# Altium project pca20054.PrjPCB
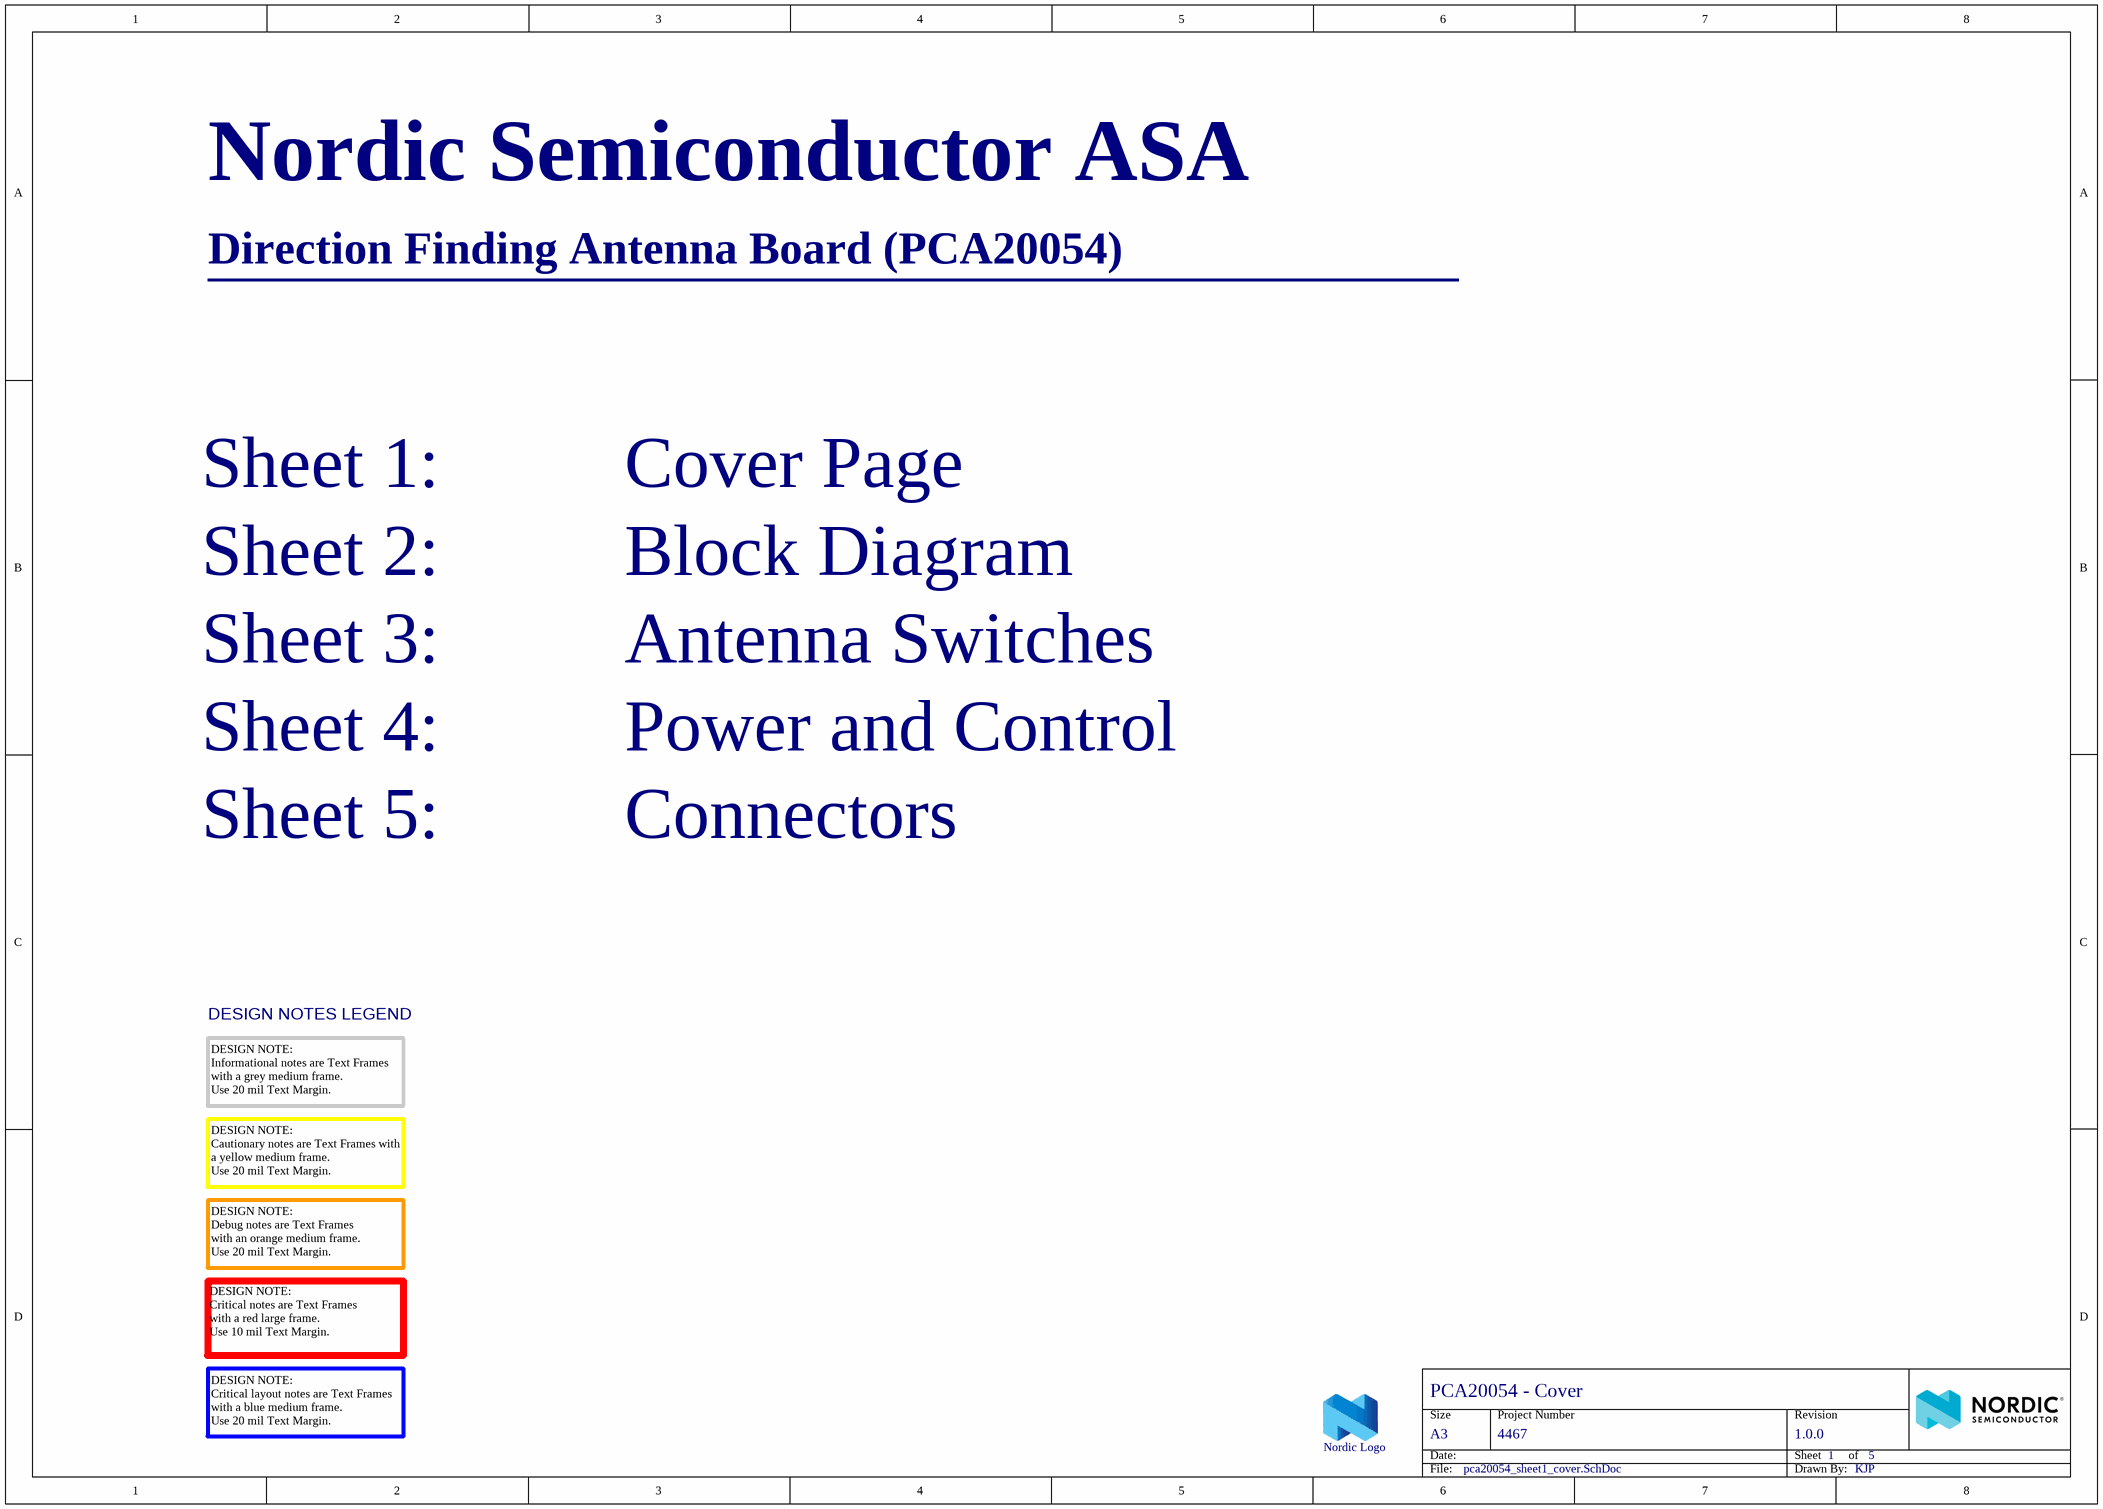
[diagram p0: pca20054_sheet1_cover.SchDoc]
Author: KJP; BoardThickness: 1.6mm; BoardTitle: Direction Finding Antenna Board; NrOfLayers: 4; Organization: Nordic Semiconductor; PCAName: PCA20054; PCBNumber: 400503; PCBRevision: 0095KJP; PCBStackup: 4001; ProjectName: Direction finding application; ProjectNumber: 4467; Revision: 1.0.0; SilkscreenColor: White; SoldermaskColor: Green; SurfaceFinish: ENIG Gold
5 sheets, 173 parts. Net scope: flat (ports and power ports of the same name join across sheets).
Board file: 400503.PcbDoc
Sheets:
  pca20054_sheet1_cover.SchDoc
  pca20054_sheet2_block_diagram.SchDoc
  pca20054_sheet3_antenna_switches.SchDoc
  pca20054_sheet4_power_control.SchDoc
  pca20054_sheet5_connectors.SchDoc

## Sheet pca20054_sheet1_cover.SchDoc: PCA20054 - Cover
size A3; Organization: Nordic Semiconductor; DocumentNumber: 1; Revision: 1.0.0; SheetNumber: 1; SheetTotal: 5; Date: 2020-02-07; CompanyName: Nordic Semiconductor; DrawnBy: KJP; ProjectNumber: 4467; ProjectName: Direction finding application

### Parts
LOGO?  Nordic Logo  [NORDIC_LOGO_LYING]  (no BOM)

### Notes on the sheet
- Nordic Semiconductor ASA
- Direction Finding Antenna Board (PCA20054)
- _________________________________________
- Sheet 1:          Cover Page
- Sheet 2:          Block Diagram
- Sheet 3:          Antenna Switches
- Sheet 4:          Power and Control
- Sheet 5:          Connectors
- DESIGN NOTES LEGEND
- DESIGN NOTE:
  Informational notes are Text Frames with a grey medium frame.
  Use 20 mil Text Margin.
- DESIGN NOTE:
  Cautionary notes are Text Frames with a yellow medium frame.
  Use 20 mil Text Margin.
- DESIGN NOTE:
  Debug notes are Text Frames
  with an orange medium frame.
  Use 20 mil Text Margin.
- DESIGN NOTE:
  Critical notes are Text Frames
  with a red large frame.
  Use 10 mil Text Margin.
- DESIGN NOTE:
  Critical layout notes are Text Frames
  with a blue medium frame.
  Use 20 mil Text Margin.
- Size
- Date:
- A3
- Project Number
- Sheet         of
- Revision
- File:
- Drawn By:

### Library data of the parts
LOGO? = Nordic Logo lying: Artikkelnr Noca: N.A.; Part Number: Nordic Logo lying; Manufacturer: *; Manufacturer Part Number: *; ComponentLink1URL: *; ComponentLink1Description: Datasheet; ComponentLink2URL: *; ComponentLink2Description: Supplier link; HelpURL: *; Footprint Doc: Nordic Logo; LatestRevisionDate: 2017-03-20; Pin Count: 0; Publisher: Nordic Semiconductor; Published: 2017-09-01; Value: Nordic Logo; Note: *; Supplier 1: *; Supplier Part Number 1: *; Supplier 2: *; Supplier Part Number 2: *; Part number IPS: N.A.

## Sheet pca20054_sheet2_block_diagram.SchDoc: PCA20054 - Block Diagram
size A3; Organization: Nordic Semiconductor; DocumentNumber: 1; Revision: 1.0.0; SheetNumber: 2; SheetTotal: 5; Date: 2020-02-07; CompanyName: Nordic Semiconductor; DrawnBy: KJP; ProjectNumber: 4467; ProjectName: Direction finding application
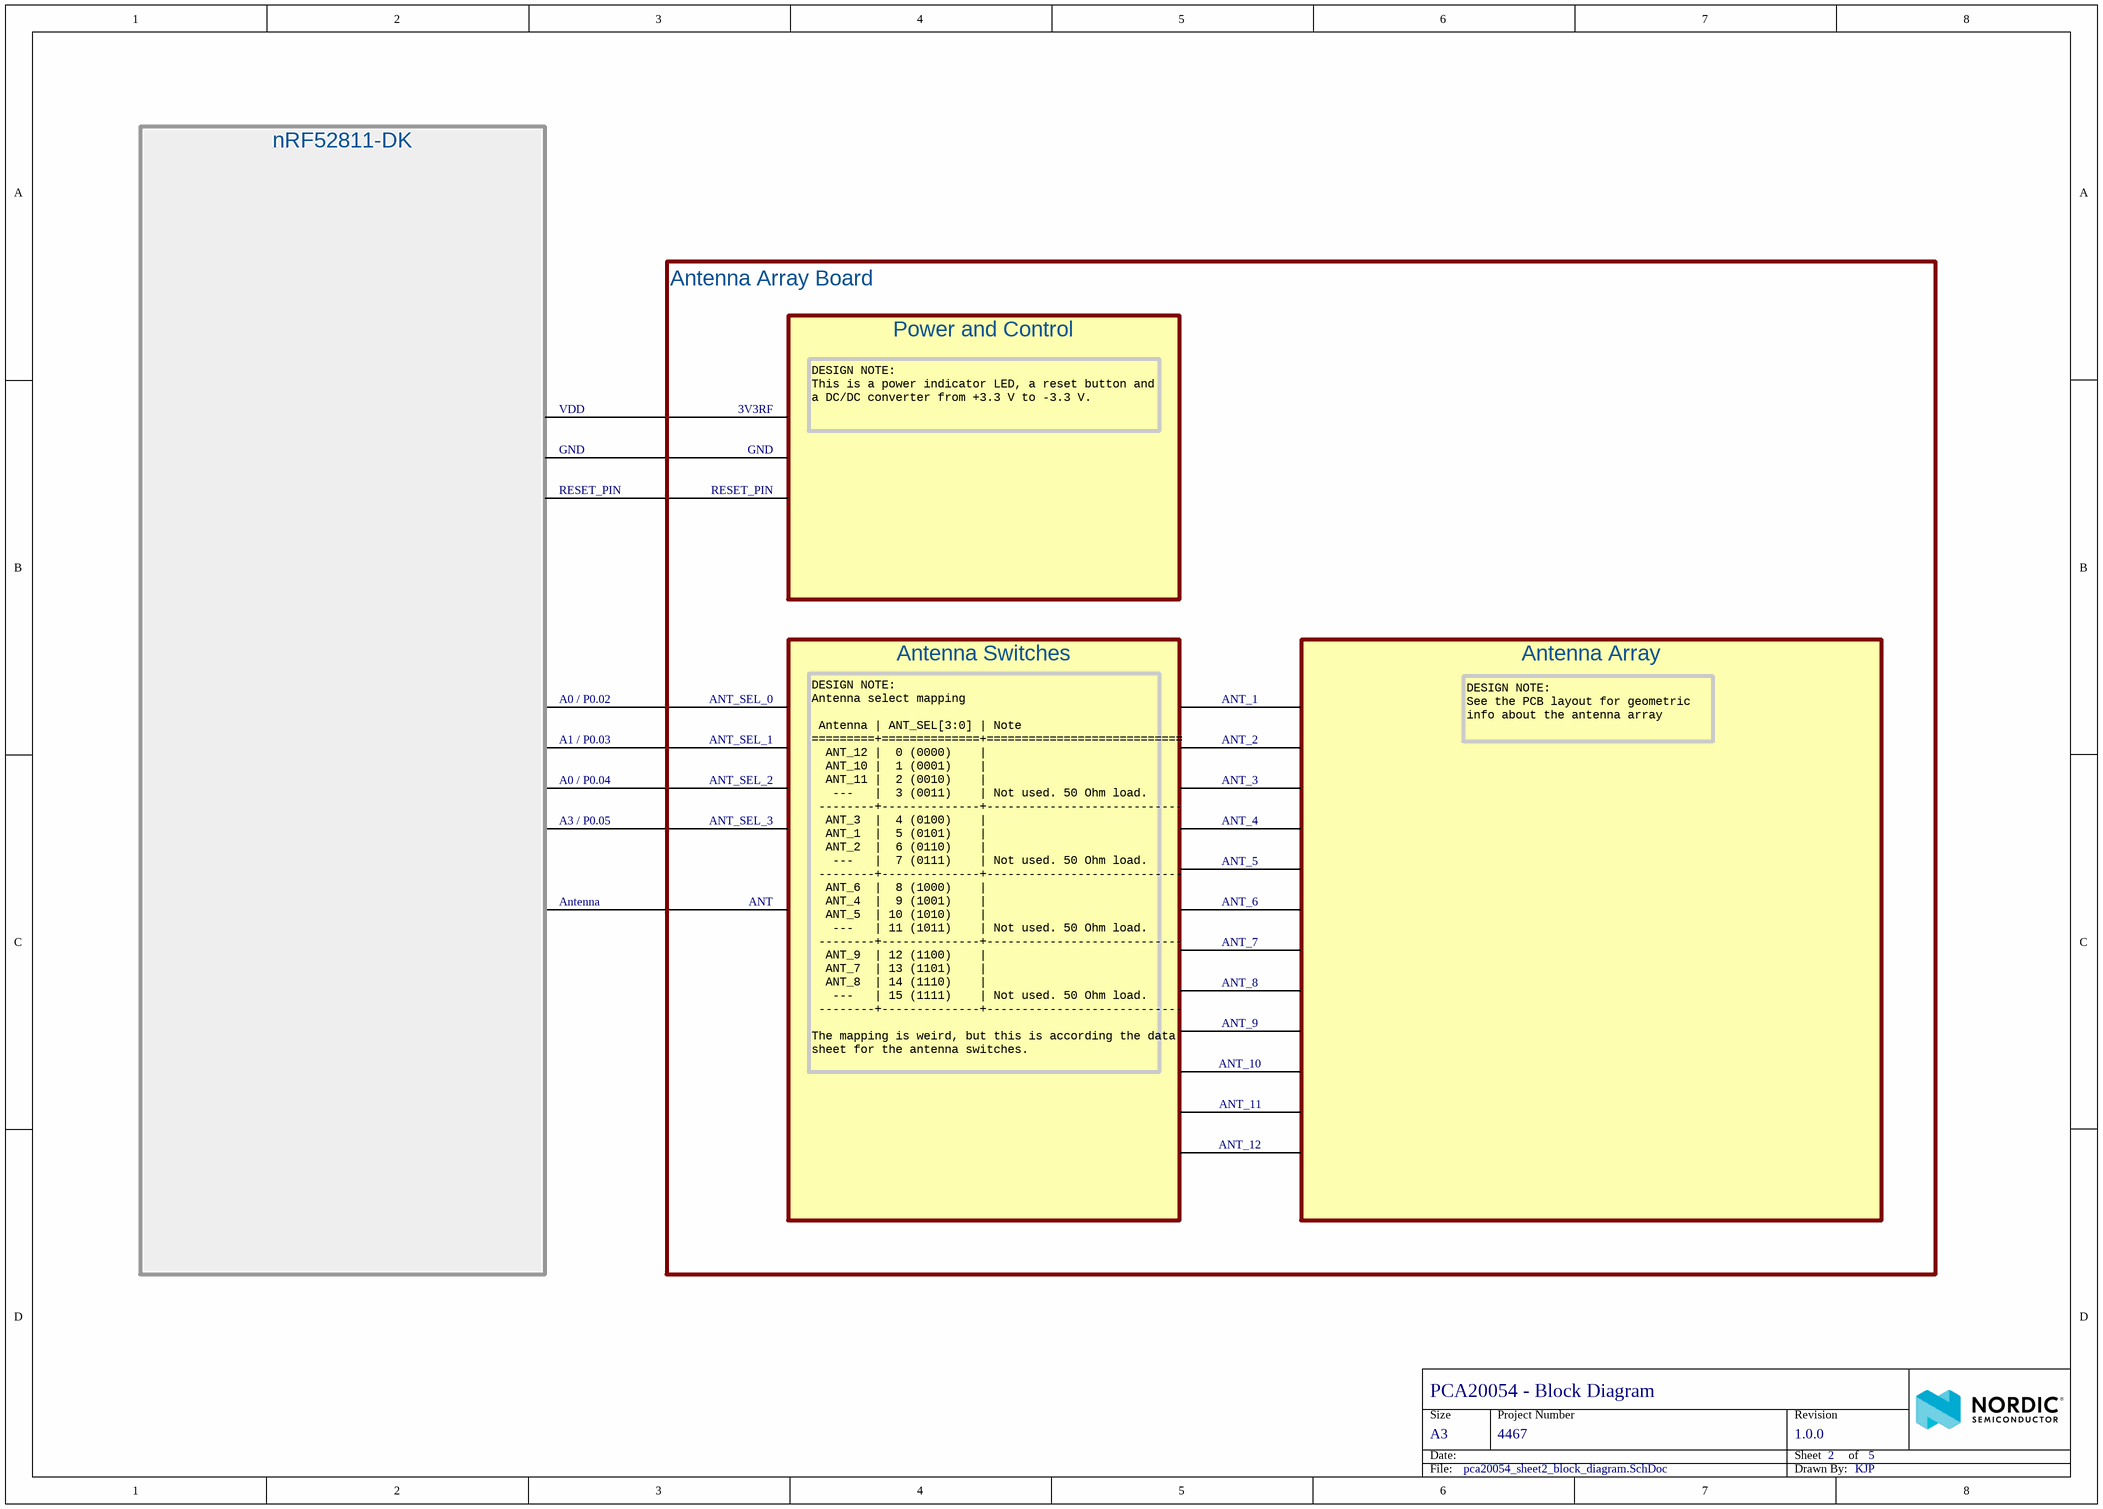
[diagram p1: pca20054_sheet2_block_diagram.SchDoc]

### Notes on the sheet
- GND
- VDD
- 3V3RF
- DESIGN NOTE:
  This is a power indicator LED, a reset button and a DC/DC converter from +3.3 V to -3.3 V.
- RESET_PIN
- Power and Control
- A0 / P0.02
- ANT_SEL_0
- ANT_1
- A0 / P0.04
- A1 / P0.03
- ANT_SEL_2
- ANT_SEL_1
- ANT_3
- ANT_2
- DESIGN NOTE:
  See the PCB layout for geometric info about the antenna array
- A3 / P0.05
- ANT_SEL_3
- ANT_4
- Antenna
- ANT
- ANT_6
- ANT_5
- ANT_8
- ANT_7
- ANT_9
- DESIGN NOTE:
  Antenna select mapping
  Antenna | ANT_SEL[3:0] | Note
  =========+==============+============================
  ANT_12 |  0 (0000)    |
  ANT_10 |  1 (0001)    |
  ANT_11 |  2 (0010)    |
  ---   |  3 (0011)    | Not used. 50 Ohm load.
  --------+--------------+----------------------------
  ANT_3  |  4 (0100)    |
  ANT_1  |  5 (0101)    |
  ANT_2  |  6 (0110)    |
  ---   |  7 (0111)    | Not used. 50 Ohm load.
  --------+--------------+----------------------------
  ANT_6  |  8 (1000)    |
  ANT_4  |  9 (1001)    |
  ANT_5  | 10 (1010)    |
  ---   | 11 (1011)    | Not used. 50 Ohm load.
  --------+--------------+----------------------------
  ANT_9  | 12 (1100)    |
  ANT_7  | 13 (1101)    |
  ANT_8  | 14 (1110)    |
  ---   | 15 (1111)    | Not used. 50 Ohm load.
  --------+--------------+----------------------------
  The mapping is weird, but this is according the data
  sheet for the antenna switches.
- ANT_11
- ANT_10
- ANT_12
- Antenna Switches
- Antenna Array
- nRF52811-DK
- Antenna Array Board
- Size
- Date:
- A3
- Project Number
- Sheet         of
- Revision
- File:
- Drawn By:

## Sheet pca20054_sheet3_antenna_switches.SchDoc: PCA20054 - Antenna Switches
size A2; Organization: Nordic Semiconductor; DocumentNumber: 0; Revision: 1.0.0; SheetNumber: 3; SheetTotal: 5; Author: KJP; CompanyName: Nordic Semiconductor; DrawnBy: KJP; DocumentSize: A2; Project Number: 4467; ProjectName: Direction finding application
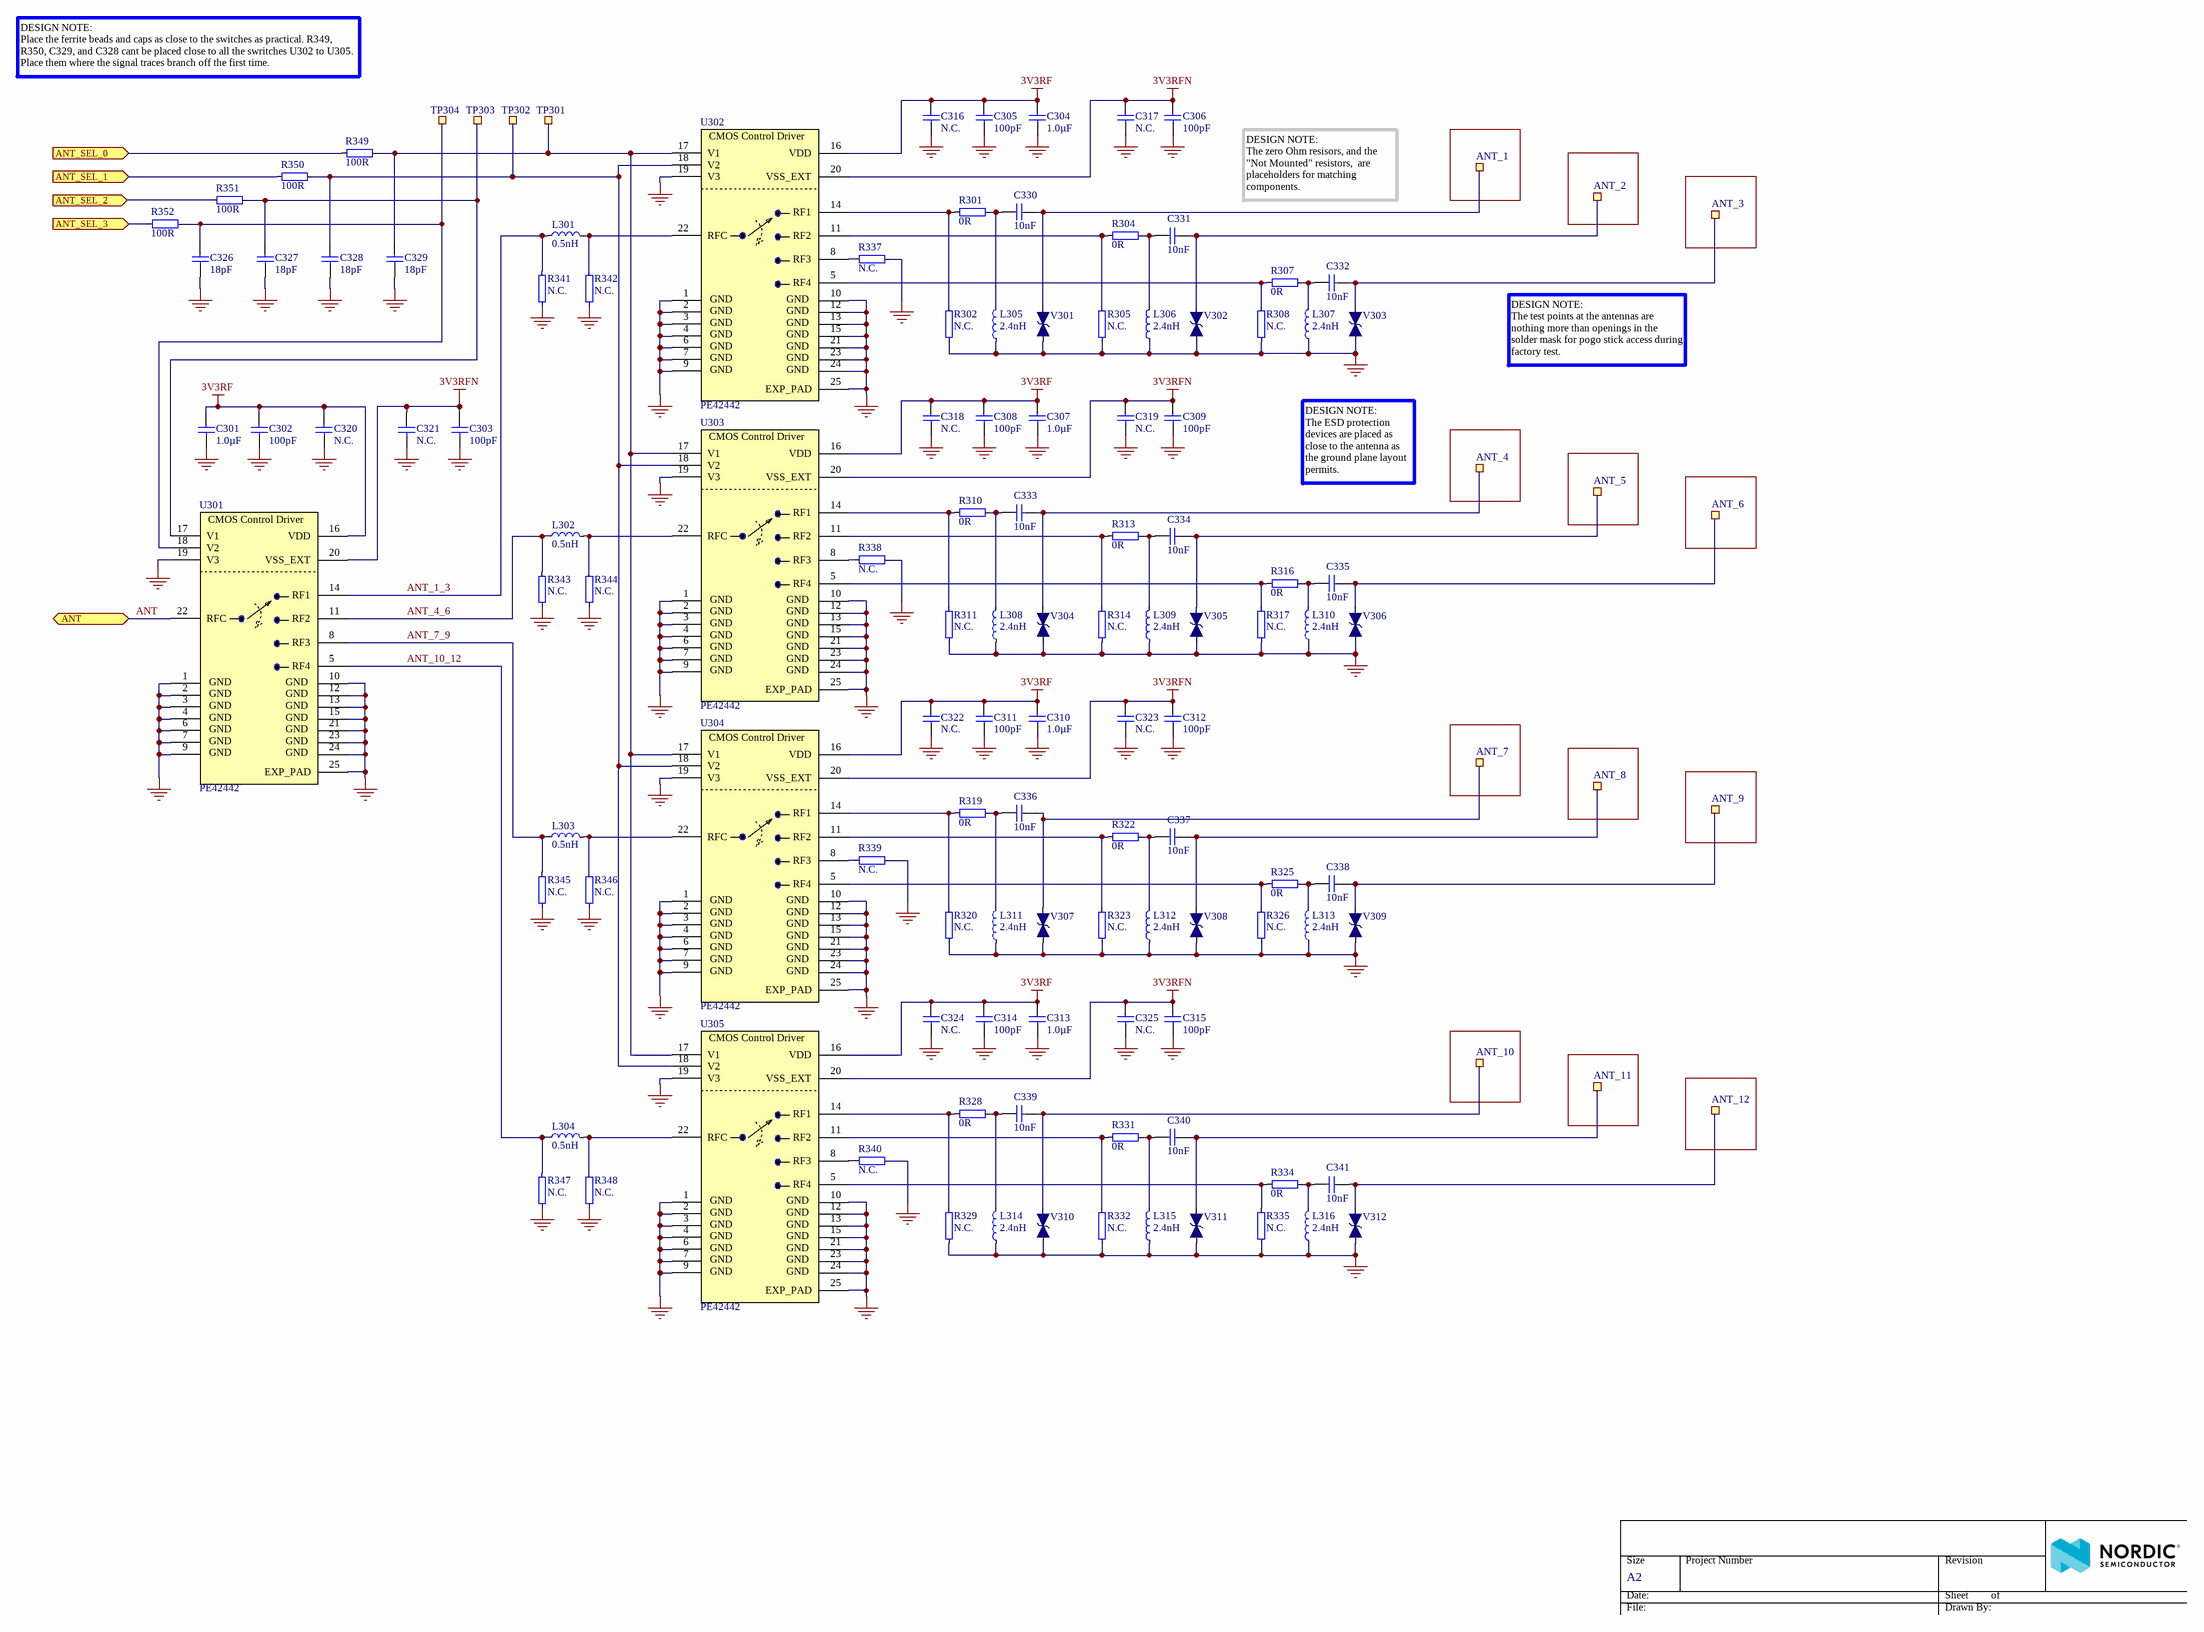
[diagram p2: pca20054_sheet3_antenna_switches.SchDoc]

### Parts
ANT_1  Ø1.0mm,SMD  [TP_SMD_Ø1.0mm]  (value not drawn)  (no BOM)
ANT_2  Ø1.0mm,SMD  [TP_SMD_Ø1.0mm]  (value not drawn)  (no BOM)
ANT_3  Ø1.0mm,SMD  [TP_SMD_Ø1.0mm]  (value not drawn)  (no BOM)
ANT_4  Ø1.0mm,SMD  [TP_SMD_Ø1.0mm]  (value not drawn)  (no BOM)
ANT_5  Ø1.0mm,SMD  [TP_SMD_Ø1.0mm]  (value not drawn)  (no BOM)
ANT_6  Ø1.0mm,SMD  [TP_SMD_Ø1.0mm]  (value not drawn)  (no BOM)
ANT_7  Ø1.0mm,SMD  [TP_SMD_Ø1.0mm]  (value not drawn)  (no BOM)
ANT_8  Ø1.0mm,SMD  [TP_SMD_Ø1.0mm]  (value not drawn)  (no BOM)
ANT_9  Ø1.0mm,SMD  [TP_SMD_Ø1.0mm]  (value not drawn)  (no BOM)
ANT_10  Ø1.0mm,SMD  [TP_SMD_Ø1.0mm]  (value not drawn)  (no BOM)
ANT_11  Ø1.0mm,SMD  [TP_SMD_Ø1.0mm]  (value not drawn)  (no BOM)
ANT_12  Ø1.0mm,SMD  [TP_SMD_Ø1.0mm]  (value not drawn)  (no BOM)
C301  1.0µF  [CAPC1608X06L]
C302  100pF  [CAPC1005X04L]
C303  100pF  [CAPC1005X04L]
C304  1.0µF  [CAPC1608X06L]
C305  100pF  [CAPC1005X04L]
C306  100pF  [CAPC1005X04L]
C307  1.0µF  [CAPC1608X06L]
C308  100pF  [CAPC1005X04L]
C309  100pF  [CAPC1005X04L]
C310  1.0µF  [CAPC1608X06L]
C311  100pF  [CAPC1005X04L]
C312  100pF  [CAPC1005X04L]
C313  1.0µF  [CAPC1608X06L]
C314  100pF  [CAPC1005X04L]
C315  100pF  [CAPC1005X04L]
C316  N.C.  [CAPC1005X04L_NC]
C317  N.C.  [CAPC1005X04L_NC]
C318  N.C.  [CAPC1005X04L_NC]
C319  N.C.  [CAPC1005X04L_NC]
C320  N.C.  [CAPC1005X04L_NC]
C321  N.C.  [CAPC1005X04L_NC]
C322  N.C.  [CAPC1005X04L_NC]
C323  N.C.  [CAPC1005X04L_NC]
C324  N.C.  [CAPC1005X04L_NC]
C325  N.C.  [CAPC1005X04L_NC]
C326  18pF  [CAPC1005X04L]
C327  18pF  [CAPC1005X04L]
C328  18pF  [CAPC1005X04L]
C329  18pF  [CAPC1005X04L]
C330  10nF  [CAPC1005X04L]
C331  10nF  [CAPC1005X04L]
C332  10nF  [CAPC1005X04L]
C333  10nF  [CAPC1005X04L]
C334  10nF  [CAPC1005X04L]
C335  10nF  [CAPC1005X04L]
C336  10nF  [CAPC1005X04L]
C337  10nF  [CAPC1005X04L]
C338  10nF  [CAPC1005X04L]
C339  10nF  [CAPC1005X04L]
C340  10nF  [CAPC1005X04L]
C341  10nF  [CAPC1005X04L]
L301  0.5nH  [INDC1005X04L]
L302  0.5nH  [INDC1005X04L]
L303  0.5nH  [INDC1005X04L]
L304  0.5nH  [INDC1005X04L]
L305  2.4nH  [INDC1005X04L]
L306  2.4nH  [INDC1005X04L]
L307  2.4nH  [INDC1005X04L]
L308  2.4nH  [INDC1005X04L]
L309  2.4nH  [INDC1005X04L]
L310  2.4nH  [INDC1005X04L]
L311  2.4nH  [INDC1005X04L]
L312  2.4nH  [INDC1005X04L]
L313  2.4nH  [INDC1005X04L]
L314  2.4nH  [INDC1005X04L]
L315  2.4nH  [INDC1005X04L]
L316  2.4nH  [INDC1005X04L]
R301  0R  [RESC1005X04L]
R302  N.C.  [RESC1005X04L_NC]
R304  0R  [RESC1005X04L]
R305  N.C.  [RESC1005X04L_NC]
R307  0R  [RESC1005X04L]
R308  N.C.  [RESC1005X04L_NC]
R310  0R  [RESC1005X04L]
R311  N.C.  [RESC1005X04L_NC]
R313  0R  [RESC1005X04L]
R314  N.C.  [RESC1005X04L_NC]
R316  0R  [RESC1005X04L]
R317  N.C.  [RESC1005X04L_NC]
R319  0R  [RESC1005X04L]
R320  N.C.  [RESC1005X04L_NC]
R322  0R  [RESC1005X04L]
R323  N.C.  [RESC1005X04L_NC]
R325  0R  [RESC1005X04L]
R326  N.C.  [RESC1005X04L_NC]
R328  0R  [RESC1005X04L]
R329  N.C.  [RESC1005X04L_NC]
R331  0R  [RESC1005X04L]
R332  N.C.  [RESC1005X04L_NC]
R334  0R  [RESC1005X04L]
R335  N.C.  [RESC1005X04L_NC]
R337  N.C.  [RESC1005X04L_NC]
R338  N.C.  [RESC1005X04L_NC]
R339  N.C.  [RESC1005X04L_NC]
R340  N.C.  [RESC1005X04L_NC]
R341  N.C.  [RESC1005X04L_NC]
R342  N.C.  [RESC1005X04L_NC]
R343  N.C.  [RESC1005X04L_NC]
R344  N.C.  [RESC1005X04L_NC]
R345  N.C.  [RESC1005X04L_NC]
R346  N.C.  [RESC1005X04L_NC]
R347  N.C.  [RESC1005X04L_NC]
R348  N.C.  [RESC1005X04L_NC]
R349  100R  [RESC1005X04L]
R350  100R  [RESC1005X04L]
R351  100R  [RESC1005X04L]
R352  100R  [RESC1005X04L]
TP301  Ø1.0mm,SMD  [TP_SMD_Ø1.0mm]  (value not drawn)  (no BOM)
TP302  Ø1.0mm,SMD  [TP_SMD_Ø1.0mm]  (value not drawn)  (no BOM)
TP303  Ø1.0mm,SMD  [TP_SMD_Ø1.0mm]  (value not drawn)  (no BOM)
TP304  Ø1.0mm,SMD  [TP_SMD_Ø1.0mm]  (value not drawn)  (no BOM)
U301  PE42442  [QFN50P400X400X80_HS-25N]
U302  PE42442  [QFN50P400X400X80_HS-25N]
U303  PE42442  [QFN50P400X400X80_HS-25N]
U304  PE42442  [QFN50P400X400X80_HS-25N]
U305  PE42442  [QFN50P400X400X80_HS-25N]
V301  LXES15AAA1-133  [RESC1005X04L]  (value not drawn)
V302  LXES15AAA1-133  [RESC1005X04L]  (value not drawn)
V303  LXES15AAA1-133  [RESC1005X04L]  (value not drawn)
V304  LXES15AAA1-133  [RESC1005X04L]  (value not drawn)
V305  LXES15AAA1-133  [RESC1005X04L]  (value not drawn)
V306  LXES15AAA1-133  [RESC1005X04L]  (value not drawn)
V307  LXES15AAA1-133  [RESC1005X04L]  (value not drawn)
V308  LXES15AAA1-133  [RESC1005X04L]  (value not drawn)
V309  LXES15AAA1-133  [RESC1005X04L]  (value not drawn)
V310  LXES15AAA1-133  [RESC1005X04L]  (value not drawn)
V311  LXES15AAA1-133  [RESC1005X04L]  (value not drawn)
V312  LXES15AAA1-133  [RESC1005X04L]  (value not drawn)

### Ports
ANT (bidir), ANT_SEL_0 (in), ANT_SEL_1 (in), ANT_SEL_2 (in), ANT_SEL_3 (in)

### Nets
3V3RF: C301.2 C302.2 C304.2 C305.2 C307.2 C308.2 C310.2 C311.2 C313.2 C314.2 C316.2 C318.2 C320.2 C322.2 C324.2 U301.16(VDD) U302.16(VDD) U303.16(VDD) U304.16(VDD) U305.16(VDD)
3V3RFN: C303.2 C306.2 C309.2 C312.2 C315.2 C317.2 C319.2 C321.2 C323.2 C325.2 U301.20(VSS_EXT) U302.20(VSS_EXT) U303.20(VSS_EXT) U304.20(VSS_EXT) U305.20(VSS_EXT)
GND: C301.1 C302.1 C303.1 C304.1 C305.1 C306.1 C307.1 C308.1 C309.1 C310.1 C311.1 C312.1 C313.1 C314.1 C315.1 C316.1 C317.1 C318.1 C319.1 C320.1 C321.1 C322.1 C323.1 C324.1 C325.1 C326.1 C327.1 C328.1 C329.1 L305.1 L306.1 L307.1 L308.1 L309.1 L310.1 L311.1 L312.1 L313.1 L314.1 L315.1 L316.1 R302.1 R305.1 R308.1 R311.1 R314.1 R317.1 R320.1 R323.1 R326.1 R329.1 R332.1 R335.1 R337.2 R338.2 R339.2 R340.2 R341.1 R342.1 R343.1 R344.1 R345.1 R346.1 R347.1 R348.1 U301.1(GND1) U301.2(GND2) U301.3(GND3) U301.4(GND4) U301.6(GND5) U301.7(GND6) U301.9(GND7) U301.10(GND8) U301.12(GND9) U301.13(GND10) U301.15(GND11) U301.19(V3) U301.21(GND12) U301.23(GND14) U301.24(GND13) U301.25(EXP_PAD) U302.1(GND1) U302.2(GND2) U302.3(GND3) U302.4(GND4) U302.6(GND5) U302.7(GND6) U302.9(GND7) U302.10(GND8) U302.12(GND9) U302.13(GND10) U302.15(GND11) U302.19(V3) U302.21(GND12) U302.23(GND14) U302.24(GND13) U302.25(EXP_PAD) U303.1(GND1) U303.2(GND2) U303.3(GND3) U303.4(GND4) U303.6(GND5) U303.7(GND6) U303.9(GND7) U303.10(GND8) U303.12(GND9) U303.13(GND10) U303.15(GND11) U303.19(V3) U303.21(GND12) U303.23(GND14) U303.24(GND13) U303.25(EXP_PAD) U304.1(GND1) U304.2(GND2) U304.3(GND3) U304.4(GND4) U304.6(GND5) U304.7(GND6) U304.9(GND7) U304.10(GND8) U304.12(GND9) U304.13(GND10) U304.15(GND11) U304.19(V3) U304.21(GND12) U304.23(GND14) U304.24(GND13) U304.25(EXP_PAD) U305.1(GND1) U305.2(GND2) U305.3(GND3) U305.4(GND4) U305.6(GND5) U305.7(GND6) U305.9(GND7) U305.10(GND8) U305.12(GND9) U305.13(GND10) U305.15(GND11) U305.19(V3) U305.21(GND12) U305.23(GND14) U305.24(GND13) U305.25(EXP_PAD) V301.2 V302.2 V303.2 V304.2 V305.2 V306.2 V307.2 V308.2 V309.2 V310.2 V311.2 V312.2
ANT: U301.22(RFC) ; port ANT
ANT_1_3: L301.1 R341.2 U301.14(RF1)
ANT_4_6: L302.1 R343.2 U301.11(RF2)
ANT_7_9: L303.1 R345.2 U301.8(RF3)
ANT_10_12: L304.1 R347.2 U301.5(RF4)
NetANT_1_1: ANT_1.1 C330.2 V301.1
NetANT_2_1: ANT_2.1 C331.2 V302.1
NetANT_3_1: ANT_3.1 C332.2 V303.1
NetANT_4_1: ANT_4.1 C333.2 V304.1
NetANT_5_1: ANT_5.1 C334.2 V305.1
NetANT_6_1: ANT_6.1 C335.2 V306.1
NetANT_7_1: ANT_7.1 C336.2 V307.1
NetANT_8_1: ANT_8.1 C337.2 V308.1
NetANT_9_1: ANT_9.1 C338.2 V309.1
NetANT_10_1: ANT_10.1 C339.2 V310.1
NetANT_11_1: ANT_11.1 C340.2 V311.1
NetANT_12_1: ANT_12.1 C341.2 V312.1
NetC326_2: C326.2 R352.2 TP304.1 U301.18(V2)
NetC327_2: C327.2 R351.2 TP303.1 U301.17(V1)
NetC328_2: C328.2 R350.2 TP302.1 U302.18(V2) U303.18(V2) U304.18(V2) U305.18(V2)
NetC329_2: C329.2 R349.2 TP301.1 U302.17(V1) U303.17(V1) U304.17(V1) U305.17(V1)
NetC330_1: C330.1 L305.2 R301.2
NetC331_1: C331.1 L306.2 R304.2
NetC332_1: C332.1 L307.2 R307.2
NetC333_1: C333.1 L308.2 R310.2
NetC334_1: C334.1 L309.2 R313.2
NetC335_1: C335.1 L310.2 R316.2
NetC336_1: C336.1 L311.2 R319.2
NetC337_1: C337.1 L312.2 R322.2
NetC338_1: C338.1 L313.2 R325.2
NetC339_1: C339.1 L314.2 R328.2
NetC340_1: C340.1 L315.2 R331.2
NetC341_1: C341.1 L316.2 R334.2
NetL301_2: L301.2 R342.2 U302.22(RFC)
NetL302_2: L302.2 R344.2 U303.22(RFC)
NetL303_2: L303.2 R346.2 U304.22(RFC)
NetL304_2: L304.2 R348.2 U305.22(RFC)
NetP2_1: R349.1 ; port ANT_SEL_0
NetP2_2: R350.1 ; port ANT_SEL_1
NetP2_3: R351.1 ; port ANT_SEL_2
NetP2_4: R352.1 ; port ANT_SEL_3
NetR301_1: R301.1 R302.2 U302.14(RF1)
NetR304_1: R304.1 R305.2 U302.11(RF2)
NetR307_1: R307.1 R308.2 U302.5(RF4)
NetR310_1: R310.1 R311.2 U303.14(RF1)
NetR313_1: R313.1 R314.2 U303.11(RF2)
NetR316_1: R316.1 R317.2 U303.5(RF4)
NetR319_1: R319.1 R320.2 U304.14(RF1)
NetR322_1: R322.1 R323.2 U304.11(RF2)
NetR325_1: R325.1 R326.2 U304.5(RF4)
NetR328_1: R328.1 R329.2 U305.14(RF1)
NetR331_1: R331.1 R332.2 U305.11(RF2)
NetR334_1: R334.1 R335.2 U305.5(RF4)
NetR337_1: R337.1 U302.8(RF3)
NetR338_1: R338.1 U303.8(RF3)
NetR339_1: R339.1 U304.8(RF3)
NetR340_1: R340.1 U305.8(RF3)

### Notes on the sheet
- DESIGN NOTE:
  Place the ferrite beads and caps as close to the switches as practical. R349, R350, C329, and C328 cant be placed close to all the swritches U302 to U305. Place them where the signal traces branch off the first time.
- DESIGN NOTE:
  The zero Ohm resisors, and the "Not Mounted" resistors,  are placeholders for matching components.
- DESIGN NOTE:
  The test points at the antennas are nothing more than openings in the solder mask for pogo stick access during factory test.
- DESIGN NOTE:
  The ESD protection devices are placed as close to the antenna as the ground plane layout permits.
- Size
- Date:
- File:
- A2
- Project Number
- Sheet         of
- Drawn By:
- Revision
- (in symbol PE42442) CMOS Control Driver; GND

### Library data of the parts
ANT_1-ANT_12 TP301-TP304 = TP_SMD_Ø1.0MM: 1.0mm circular SMD testpad; Manufacturer: Nordic Semiconductor; Artikkelnr Noca: N.A.; Part Number: TP_SMD_Ø1.0MM; Manufacturer Part Number: *; ComponentLink1URL: *; ComponentLink1Description: Datasheet; ComponentLink2URL: *; ComponentLink2Description: Supplier link; HelpURL: *; Footprint Doc: TP_SMD_Ø1.0mm; LatestRevisionDate: 2013-06-11; Pin Count: 1; Publisher: Nordic Semiconductor; Published: 2013-06-11; Value: Ø1.0mm,SMD; Note: *; Supplier 1: *; Supplier Part Number 1: *; Supplier 2: *; Supplier Part Number 2: *; Part number IPS: N.A.
C301 C304 C307 C310 C313 = C0603-1µ0: Capacitor, X7R, ±10%; Part number IPS: 00000000616; Note: 16V; Artikkelnr Noca: 20039282; Part Number: C0603-1µ0; Manufacturer: *; Manufacturer Part Number: *; ComponentLink1URL: *; ComponentLink1Description: Datasheet; ComponentLink2URL: *; ComponentLink2Description: Supplier link; HelpURL: *; Footprint Doc: 0603; LatestRevisionDate: 2013-06-05; Pin Count: 2; Publisher: Nordic Semiconductor; Published: 2009-05-08; Value: 1.0µF; Supplier 1: *; Supplier Part Number 1: *; Supplier 2: *; Supplier Part Number 2: *
C302 C303 C305 C306 C308 C309 C311 C312 C314 C315 = C0402-100p: Capacitor, NP0, ±5%; Part number IPS: 00000002361; Note: 50V; Artikkelnr Noca: 20029135; Part Number: C0402-100p; Manufacturer: *; Manufacturer Part Number: *; ComponentLink1URL: *; ComponentLink1Description: Datasheet; ComponentLink2URL: *; ComponentLink2Description: Supplier link; HelpURL: *; Footprint Doc: 0402; LatestRevisionDate: 2009-05-08; Pin Count: 2; Publisher: Nordic Semiconductor; Published: 2009-05-08; Value: 100pF; Supplier 1: *; Supplier Part Number 1: *; Supplier 2: *; Supplier Part Number 2: *
C316-C325 = C0402-N.C.: Not mounted; Assembly: Not mounted; Note: Chip Cap; Artikkelnr Noca: N.A.; Part Number: C0402-N.C.; Manufacturer: *; Manufacturer Part Number: *; ComponentLink1URL: *; ComponentLink1Description: Datasheet; ComponentLink2URL: *; ComponentLink2Description: Supplier link; HelpURL: *; Footprint Doc: 0402; LatestRevisionDate: 2009-05-08; Pin Count: 2; Publisher: Nordic Semiconductor; Published: 2009-05-08; Value: N.C.; Supplier 1: *; Supplier Part Number 1: *; Supplier 2: *; Supplier Part Number 2: *; Part number IPS: N.A.
C326-C329 = C0402-18p: Capacitor, NP0, ±5%; Part number IPS: N.A.; Note: 50V; Artikkelnr Noca: 20029209; Part Number: C0402-18p; Manufacturer: *; Manufacturer Part Number: *; ComponentLink1URL: *; ComponentLink1Description: Datasheet; ComponentLink2URL: *; ComponentLink2Description: Supplier link; HelpURL: *; Footprint Doc: 0402; LatestRevisionDate: 2009-05-08; Pin Count: 2; Publisher: Nordic Semiconductor; Published: 2009-05-08; Value: 18pF; Supplier 1: *; Supplier Part Number 1: *; Supplier 2: *; Supplier Part Number 2: *
C330-C341 = C0402-10n: Capacitor, X7R, ±10%; Part number IPS: 00000007784; Note: 16V; Artikkelnr Noca: 20039166; Part Number: C0402-10n; Manufacturer: *; Manufacturer Part Number: *; ComponentLink1URL: *; ComponentLink1Description: Datasheet; ComponentLink2URL: *; ComponentLink2Description: Supplier link; HelpURL: *; Footprint Doc: 0402; LatestRevisionDate: 2009-11-23; Pin Count: 2; Publisher: Nordic Semiconductor; Published: 2009-05-08; Value: 10nF; Supplier 1: *; Supplier Part Number 1: *; Supplier 2: *; Supplier Part Number 2: *
L301-L304 = L0402-0n5: Inductor, 1A, ±0.1nH; Manufacturer: TDK Corporation; Manufacturer Part Number: MLG1005S0N5BT000; Note: High frequency chip inductor ±0.1nH; Artikkelnr Noca: N.A.; Part Number: L0402-0n5; ComponentLink1URL: *; ComponentLink1Description: Datasheet; ComponentLink2URL: https://product.tdk.com/info/en/catalog/datasheets/inductor_commercial_high-frequency_mlg1005s_en.pdf?ref_disty=digikey; ComponentLink2Description: Supplier link; HelpURL: *; Footprint Doc: 0402; LatestRevisionDate: 2012-09-19; Pin Count: 2; Publisher: Nordic Semiconductor; Published: 2009-05-08; Value: 0.5nH; Supplier 1: Digi-Key; Supplier Part Number 1: 445-16235-1-ND; Supplier 2: *; Supplier Part Number 2: *; Part number IPS: N.A.
L305-L316 = L0402-2n4: Inductor, 220mA, ±0.1nH; Part number IPS: N.A.; Note: High frequency chip inductor ±5%; Part Number: L0402-2n4; Manufacturer: *; Manufacturer Part Number: *; ComponentLink1URL: *; ComponentLink1Description: Datasheet; ComponentLink2URL: *; ComponentLink2Description: Supplier link; HelpURL: *; Footprint Doc: 0402; LatestRevisionDate: 2012-09-19; Pin Count: 2; Publisher: Nordic Semiconductor; Published: 2009-05-08; Value: 2.4nH; Supplier 1: *; Supplier Part Number 1: *; Supplier 2: *; Supplier Part Number 2: *; Artikkelnr Noca: *
R301 R304 R307 R310 R313 R316 R319 R322 R325 R328 R331 R334 = R0402-0R: Resistor, ±5%, 0.063W; Part number IPS: 00000007128; Note: Chip Res 5%; Artikkelnr Noca: 27049000; Part Number: R0402-0R; Manufacturer: *; Manufacturer Part Number: *; ComponentLink1URL: *; ComponentLink1Description: Datasheet; ComponentLink2URL: *; ComponentLink2Description: Supplier link; HelpURL: *; Footprint Doc: 0402; LatestRevisionDate: 2009-11-23; Pin Count: 2; Publisher: Nordic Semiconductor; Published: 2009-05-08; Value: 0R; Supplier 1: Farnell; Supplier Part Number 1: 146-9661; Supplier 2: *; Supplier Part Number 2: *
R302 R305 R308 R311 R314 R317 R320 R323 R326 R329 R332 R335 R337-R348 = R0402-N.C.: Not mounted; Assembly: Not mounted; Note: Chip Res; Artikkelnr Noca: N.A.; Part Number: R0402-N.C.; Manufacturer: *; Manufacturer Part Number: *; ComponentLink1URL: *; ComponentLink1Description: Datasheet; ComponentLink2URL: *; ComponentLink2Description: Supplier link; HelpURL: *; Footprint Doc: 0402; LatestRevisionDate: 2009-05-08; Pin Count: 2; Publisher: Nordic Semiconductor; Published: 2009-05-08; Value: N.C.; Supplier 1: *; Supplier Part Number 1: *; Supplier 2: *; Supplier Part Number 2: *; Part number IPS: N.A.
R349-R352 = R0402-100: Resistor, ±1%, 0.063W; Part number IPS: 00000002811; Note: Chip Res 1%; Artikkelnr Noca: 27049049; Part Number: R0402-100; Manufacturer: *; Manufacturer Part Number: *; ComponentLink1URL: *; ComponentLink1Description: Datasheet; ComponentLink2URL: *; ComponentLink2Description: Supplier link; HelpURL: *; Footprint Doc: 0402; LatestRevisionDate: 2009-11-23; Pin Count: 2; Publisher: Nordic Semiconductor; Published: 2009-05-08; Value: 100R; Supplier 1: Farnell; Supplier Part Number 1: 173-8837; Supplier 2: *; Supplier Part Number 2: *
U301-U305 = PE42442: UltraCMOS SP4T RF Switch 30 MHz-6 GHz; Manufacturer: Peregrine Semiconductors; Artikkelnr Noca: N.A.; Part Number: PE42442; Manufacturer Part Number: PE42442; ComponentLink1URL: http://www.psemi.com/pdf/datasheets/pe42442ds.pdf; ComponentLink1Description: Datasheet; ComponentLink2URL: https://www.digikey.com/product-detail/en/psemi/PE42442A-Z/1046-1096-1-ND/4747404; ComponentLink2Description: Supplier link; HelpURL: https://www.psemi.com/products/rf-switches/pe42442; Footprint Doc: QFN-24; LatestRevisionDate: 2020-01-17; Pin Count: 5; Publisher: Nordic Semiconductor; Published: 2020-01-17; Value: PE42442; Note: *; Supplier 1: Digi-Key; Supplier Part Number 1: 1046-1096-1-ND; Supplier 2: *; Supplier Part Number 2: *; Part number IPS: N.A.
V301-V312 = LXES15AAA1-133: TVS DIODE 15VWM 0402; Manufacturer: Murata; Artikkelnr Noca: N.A.; Part Number: LXES15AAA1-133; Manufacturer Part Number: LXES15AAA1-133; ComponentLink1URL: *; ComponentLink1Description: Datasheet; ComponentLink2URL: *; ComponentLink2Description: Supplier link; HelpURL: http://www.murata.com/en-us/products/productdata/8796832759838/CRESD-E.pdf; Footprint Doc: 0402; LatestRevisionDate: 2017-09-20; Pin Count: 2; Publisher: Nordic Semiconductor; Published: 2017-09-20; Value: LXES15AAA1-133; Note: *; Supplier 1: Digi-Key; Supplier Part Number 1: 490-13209-6-ND; Supplier 2: Mouser; Supplier Part Number 2: 81-LXES15AAA1-133; Part number IPS: N.A.

## Sheet pca20054_sheet4_power_control.SchDoc: PCA20054 - Power and Control
size A3; Organization: Nordic Semiconductor; DocumentNumber: 1; Revision: 1.0.0; SheetNumber: 4; SheetTotal: 5; Date: 2020-02-07; CompanyName: Nordic Semiconductor; DrawnBy: KJP; ProjectNumber: 4467; ProjectName: Direction finding application
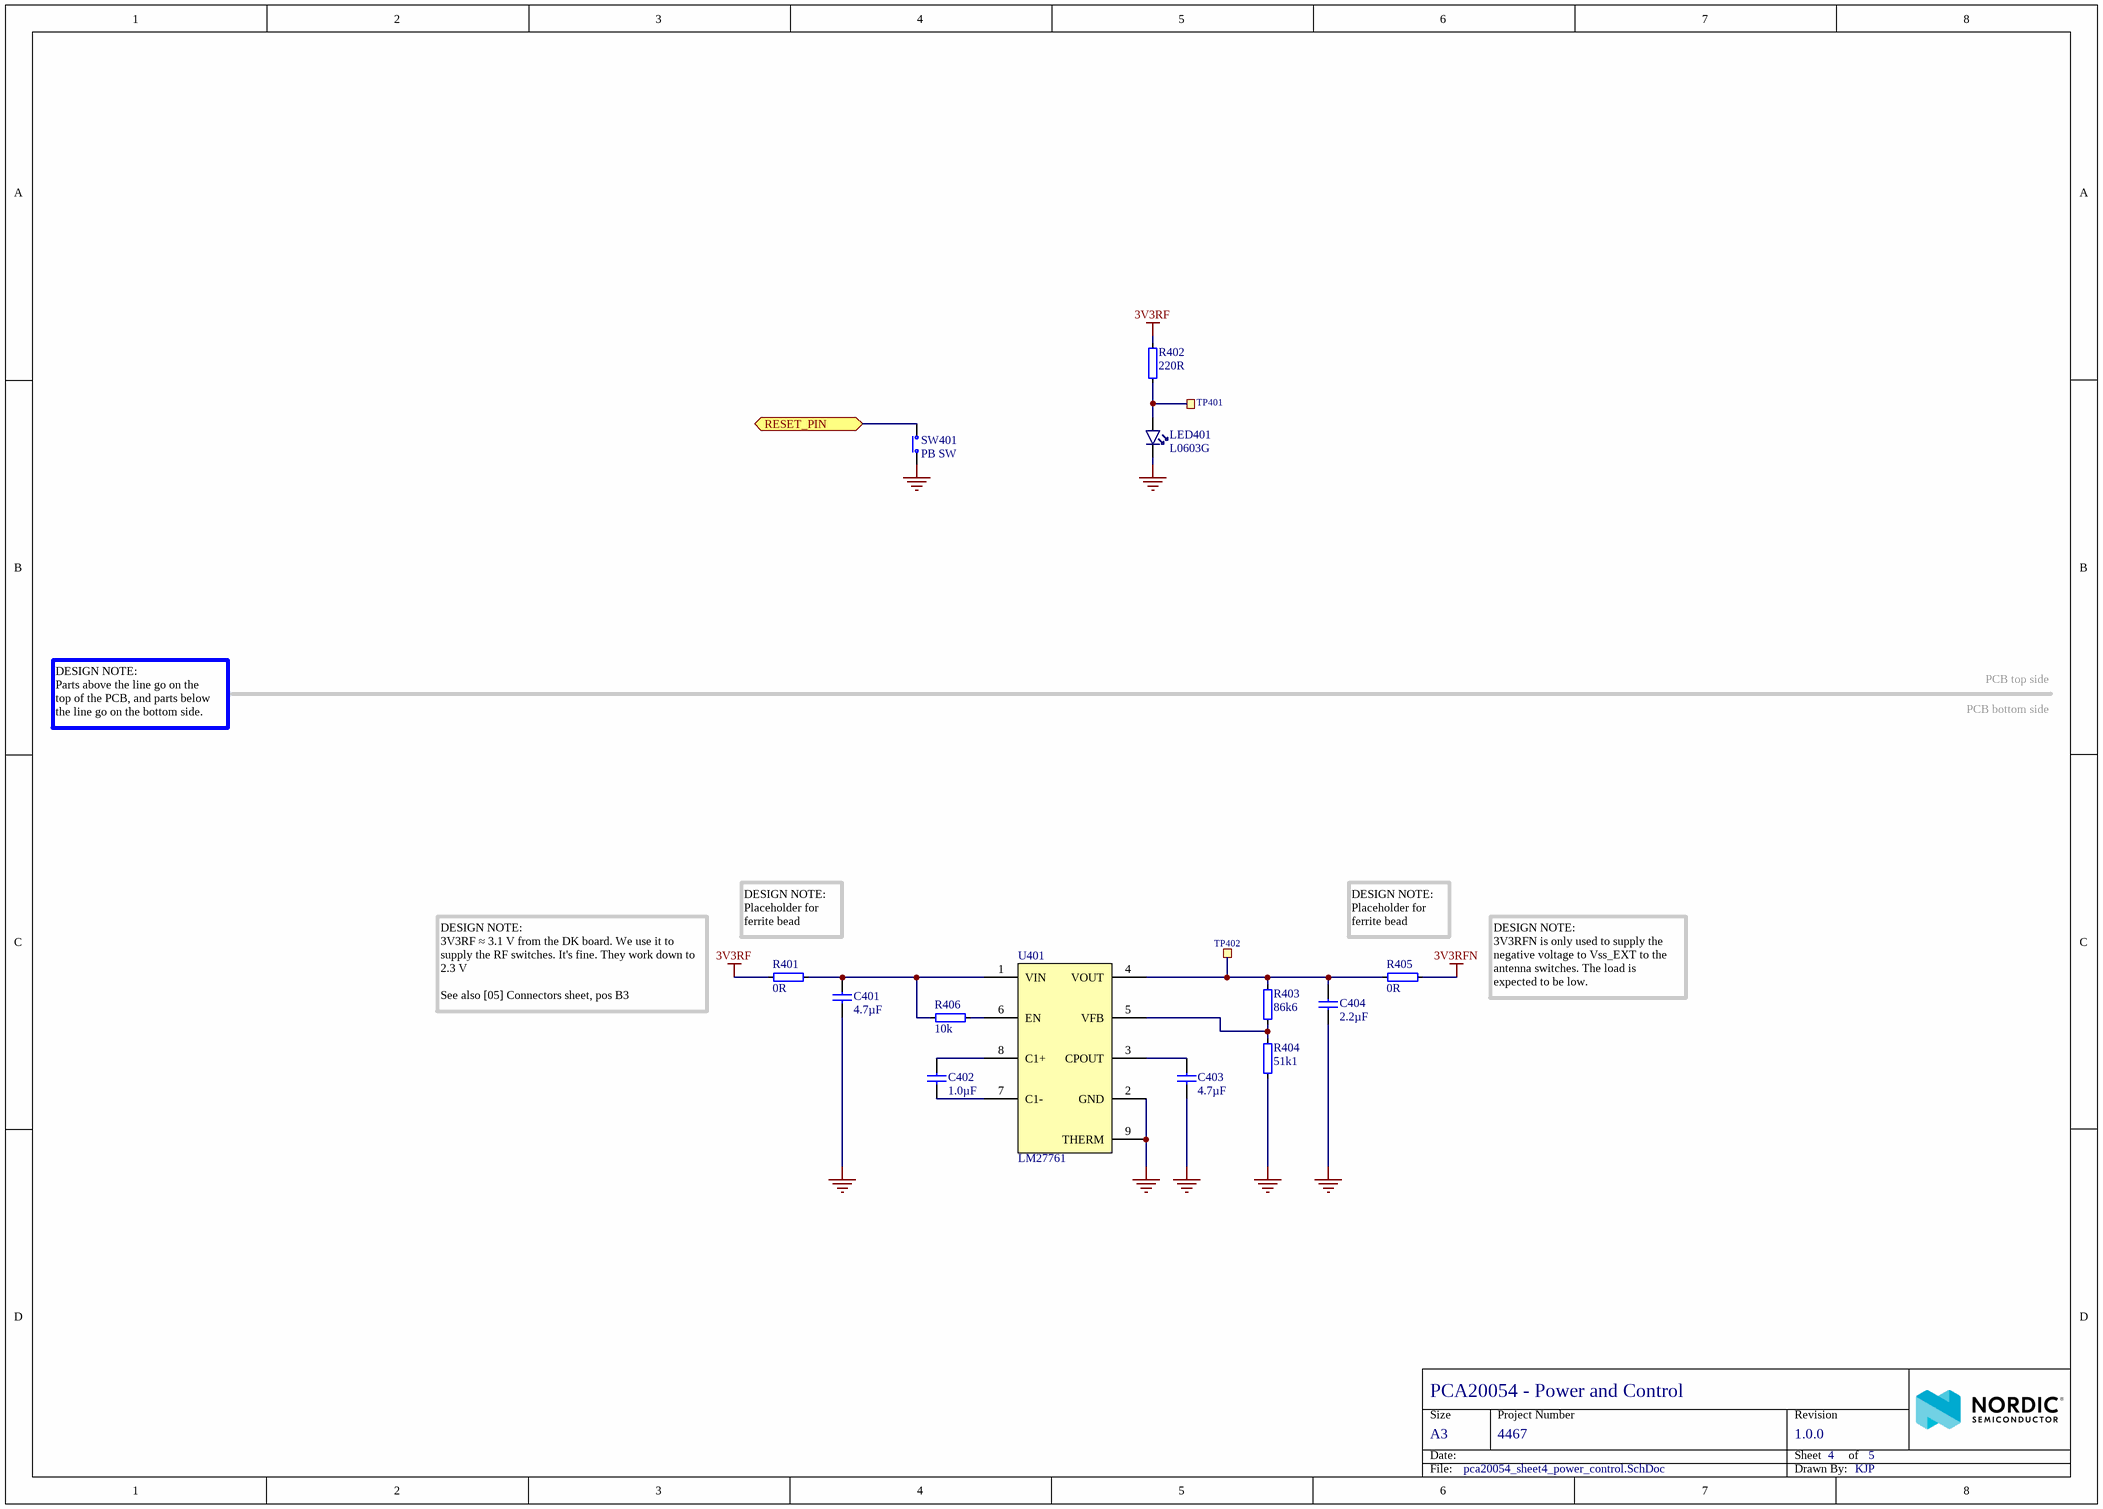
[diagram p3: pca20054_sheet4_power_control.SchDoc]

### Parts
C401  4.7µF  [CAPC1608X06L]
C402  1.0µF  [CAPC1608X06L]
C403  4.7µF  [CAPC1608X06L]
C404  2.2µF  [CAPC1608X06L]
LED401  L0603G  [LED_0603_G]
R401  0R  [RESC1005X04L]
R402  220R  [RESC1005X04L]
R403  86k6  [RESC1005X04L]
R404  51k1  [RESC1005X04L]
R405  0R  [RESC1005X04L]
R406  10k  [RESC1005X04L]
SW401  PB SW  [Switch-PB-6.2x6.3mm-SMD]
TP401  Ø1.0mm,SMD  [TP_SMD_Ø1.0mm]  (value not drawn)  (no BOM)
TP402  Ø1.0mm,SMD  [TP_SMD_Ø1.0mm]  (value not drawn)  (no BOM)
U401  LM27761  [SON50P200X80_HS-9L]

### Ports
RESET_PIN (bidir)

### Nets
3V3RF: R401.1 R402.2
3V3RFN: R405.2
GND: C401.1 C403.1 C404.1 LED401.1(C) R404.1 SW401.2(COM) U401.2(GND) U401.9(THERM)
NetC401_2: C401.2 R401.2 R406.1 U401.1(VIN)
NetC402_1: C402.1 U401.7(C1-)
NetC402_2: C402.2 U401.8(C1+)
NetC403_2: C403.2 U401.3(CPOUT)
NetC404_2: C404.2 R403.2 R405.1 TP402.1 U401.4(VOUT)
NetLED401_2: LED401.2(A) R402.1 TP401.1
NetP1_3: SW401.1(N.O) ; port RESET_PIN
NetR403_1: R403.1 R404.2 U401.5(VFB)
NetR406_2: R406.2 U401.6(EN)

### Notes on the sheet
- DESIGN NOTE:
  Parts above the line go on the
  top of the PCB, and parts below
  the line go on the bottom side.
- PCB bottom side
- PCB top side
- DESIGN NOTE:
  Placeholder for ferrite bead
- (near R405) DESIGN NOTE:
  Placeholder for ferrite bead
- DESIGN NOTE:
  3V3RFN is only used to supply the
  negative voltage to Vss_EXT to the
  antenna switches. The load is
  expected to be low.
- DESIGN NOTE:
  3V3RF ≈ 3.1 V from the DK board. We use it to supply the RF switches. It's fine. They work down to 2.3 V
  See also [05] Connectors sheet, pos B3
- Size
- Date:
- A3
- Project Number
- Sheet         of
- Revision
- File:
- Drawn By:

### Library data of the parts
C401 C403 = C0603-4µ7: Capacitor, X5R, ±10%; Part number IPS: 00000007783; Note: 6.3V; Artikkelnr Noca: 20069060; Part Number: C0603-4µ7; Manufacturer: *; Manufacturer Part Number: *; ComponentLink1URL: *; ComponentLink1Description: Datasheet; ComponentLink2URL: *; ComponentLink2Description: Supplier link; HelpURL: *; Footprint Doc: 0603; LatestRevisionDate: 2009-11-23; Pin Count: 2; Publisher: Nordic Semiconductor; Published: 2009-05-08; Value: 4.7µF; Supplier 1: *; Supplier Part Number 1: *; Supplier 2: *; Supplier Part Number 2: *
C402 = C0603-1µ0: as C301 on sheet pca20054_sheet3_antenna_switches; Part Number: C0603-1µ0; Manufacturer: *; Manufacturer Part Number: *; ComponentLink1URL: *; ComponentLink1Description: Datasheet; ComponentLink2URL: *; ComponentLink2Description: Supplier link; HelpURL: *; Footprint Doc: 0603; LatestRevisionDate: 2013-06-05; Pin Count: 2; Publisher: Nordic Semiconductor; Published: 2009-05-08; Value: 1.0µF; Supplier 1: *; Supplier Part Number 1: *; Supplier 2: *; Supplier Part Number 2: *
C404 = C0603-2µ2: Capacitor, X7R, ±10%; Part number IPS: N.A.; Note: 6.3V; Artikkelnr Noca: 20039322; Part Number: C0603-2µ2; Manufacturer: *; Manufacturer Part Number: *; ComponentLink1URL: *; ComponentLink1Description: Datasheet; ComponentLink2URL: *; ComponentLink2Description: Supplier link; HelpURL: *; Footprint Doc: 0603; LatestRevisionDate: 2016-10-10; Pin Count: 2; Publisher: Nordic Semiconductor; Published: 2009-05-08; Value: 2.2µF; Supplier 1: *; Supplier Part Number 1: *; Supplier 2: *; Supplier Part Number 2: *
LED401 = LG L29K Smartled Green: LED, Green, 0603, 570nm, Vf=1.7V, 2.24..5.6mcd, - 40 to +100°C; Manufacturer: Osram; Manufacturer Part Number: LG L29K-G2J1-24-Z; Part number IPS: 00000009961; Note: 2.24..5.6 mcd, Vfmin=1.7V; Artikkelnr Noca: 13019147; Part Number: LG L29K Smartled Green; ComponentLink1URL: *; ComponentLink1Description: Datasheet; ComponentLink2URL: *; ComponentLink2Description: Supplier link; HelpURL: http://www.osram-os.com/Graphics/XPic2/00077107_0.pdf; Footprint Doc: 0603; LatestRevisionDate: 2017-08-21; Pin Count: 2; Publisher: Nordic Semiconductor; Published: 2014-10-28; Value: L0603G; Supplier 1: Digi-Key; Supplier Part Number 1: 475-2709-1-ND; Supplier 2: Mouser; Supplier Part Number 2: 720-LGL29KG2J124Z
R401 R405 = R0402-0R: as R301 on sheet pca20054_sheet3_antenna_switches; Part Number: R0402-0R; Manufacturer: *; Manufacturer Part Number: *; ComponentLink1URL: *; ComponentLink1Description: Datasheet; ComponentLink2URL: *; ComponentLink2Description: Supplier link; HelpURL: *; Footprint Doc: 0402; LatestRevisionDate: 2009-11-23; Pin Count: 2; Publisher: Nordic Semiconductor; Published: 2009-05-08; Value: 0R; Supplier 1: Farnell; Supplier Part Number 1: 146-9661; Supplier 2: *; Supplier Part Number 2: *
R402 = R0402-220: Resistor, ±1%, 0.063W; Part number IPS: N.A.; Note: Chip Res 1%; Artikkelnr Noca: 27049057; Part Number: R0402-220; Manufacturer: *; Manufacturer Part Number: *; ComponentLink1URL: *; ComponentLink1Description: Datasheet; ComponentLink2URL: *; ComponentLink2Description: Supplier link; HelpURL: *; Footprint Doc: 0402; LatestRevisionDate: 2009-11-23; Pin Count: 2; Publisher: Nordic Semiconductor; Published: 2009-05-08; Value: 220R; Supplier 1: Farnell; Supplier Part Number 1: 173-8841; Supplier 2: *; Supplier Part Number 2: *
R403 = R0402-86k6: Resistor, ±1%, 0.063W; Manufacturer: Panasonic; Manufacturer Part Number: ERJ-2RKF8662X; Part number IPS: N.A.; Note: Chip Res 1%; Artikkelnr Noca: 27049119; Part Number: R0402-86k6; ComponentLink1URL: *; ComponentLink1Description: Datasheet; ComponentLink2URL: *; ComponentLink2Description: Supplier link; HelpURL: *; Footprint Doc: 0402; LatestRevisionDate: 2009-11-23; Pin Count: 2; Publisher: Nordic Semiconductor; Published: 2009-05-08; Value: 86k6; Supplier 1: Digi-Key; Supplier Part Number 1: P86.6KLCT-ND; Supplier 2: Mouser; Supplier Part Number 2: 667-ERJ-2RKF8662X
R404 = R0402-51k1: Resistor, ±0.1%, 0.063W; Manufacturer: Panasonic; Manufacturer Part Number: ERA-2AEB5112X; Note: Chip Res 1%; Artikkelnr Noca: N.A.; Part Number: R0402-51k1; ComponentLink1URL: *; ComponentLink1Description: Datasheet; ComponentLink2URL: *; ComponentLink2Description: Supplier link; HelpURL: *; Footprint Doc: 0402; LatestRevisionDate: 2016-11-24; Pin Count: 2; Publisher: Nordic Semiconductor; Published: 2016-11-24; Value: 51k1; Supplier 1: Digi-Key; Supplier Part Number 1: P51.1KDCCT-ND; Supplier 2: Mouser; Supplier Part Number 2: 667-ERA-2AEB5112X; Part number IPS: N.A.
R406 = R0402-10k: Resistor, ±1%, 0.063W; Part number IPS: 00000002093; Note: Chip Res 1%; Artikkelnr Noca: 27049097; Part Number: R0402-10k; Manufacturer: *; Manufacturer Part Number: *; ComponentLink1URL: *; ComponentLink1Description: Datasheet; ComponentLink2URL: *; ComponentLink2Description: Supplier link; HelpURL: *; Footprint Doc: 0402; LatestRevisionDate: 2009-11-23; Pin Count: 2; Publisher: Nordic Semiconductor; Published: 2009-05-08; Value: 10k; Supplier 1: Farnell; Supplier Part Number 1: 173-8864; Supplier 2: *; Supplier Part Number 2: *
SW401 = Switch-PB-6.2x6.3mm-SMD: Tactile Switch, SPNO, SMD, 160gf, 6.2x6.3x2.5mm; Manufacturer: Dailywell; Manufacturer Part Number: TS604VM1-025BR-R; Part number IPS: 00000007812; Artikkelnr Noca: 50019106; Part Number: Switch-PB-6.2x6.3mm-SMD; ComponentLink1URL: *; ComponentLink1Description: Datasheet; ComponentLink2URL: *; ComponentLink2Description: Supplier link; HelpURL: \\hizz\pro\app9717\Datasheet\switches\Dailywell\TS604VM1-025BR-R.pdf; Footprint Doc: Switch-PB-6.2x6.3mm-SMD; LatestRevisionDate: 2016-04-21; Pin Count: 4; Publisher: Nordic Semiconductor; Published: 2010-02-01; Value: PB SW; Note: *; Supplier 1: Cabcon; Supplier Part Number 1: TS604VM1-025BR-R; Supplier 2: Mouser; Supplier Part Number 2: 688-SKHUALE010
TP401 TP402 = TP_SMD_Ø1.0MM: as ANT_1 on sheet pca20054_sheet3_antenna_switches; Part Number: TP_SMD_Ø1.0MM; Manufacturer Part Number: *; ComponentLink1URL: *; ComponentLink1Description: Datasheet; ComponentLink2URL: *; ComponentLink2Description: Supplier link; HelpURL: *; Footprint Doc: TP_SMD_Ø1.0mm; LatestRevisionDate: 2013-06-11; Pin Count: 1; Publisher: Nordic Semiconductor; Published: 2013-06-11; Value: Ø1.0mm,SMD; Note: *; Supplier 1: *; Supplier Part Number 1: *; Supplier 2: *; Supplier Part Number 2: *; Part number IPS: N.A.
U401 = LM27761: Low-Noise, Regulated, Switched-Capacitor Voltage Inverter; Manufacturer: Texas Instruments; Note: DSGT: 250 pts reel; Artikkelnr Noca: N.A.; Part Number: LM27761; Manufacturer Part Number: LM27761; ComponentLink1URL: http://www.ti.com/lit/ds/symlink/lm27761.pdf; ComponentLink1Description: Datasheet; ComponentLink2URL: https://www.digikey.com/product-detail/en/texas-instruments/LM27761DSGT/296-43882-1-ND/5880550; ComponentLink2Description: Supplier link; HelpURL: https://www.ti.com/product/LM27761; Footprint Doc: WSON-8; LatestRevisionDate: 2020-01-17; Pin Count: 8; Publisher: Nordic Semiconductor; Published: 2020-01-17; Value: LM27761; Supplier 1: Digi-Key; Supplier Part Number 1: 296-43882-1-ND; Supplier 2: Mouser; Supplier Part Number 2: 595-LM27761DSGR; Part number IPS: N.A.

## Sheet pca20054_sheet5_connectors.SchDoc: PCA20054 - Connectors
size A3; Organization: Nordic Semiconductor; DocumentNumber: 1; Revision: 1.0.0; SheetNumber: 5; SheetTotal: 5; Date: 2020-02-07; CompanyName: Nordic Semiconductor; DrawnBy: KJP; ProjectNumber: 4467; ProjectName: Direction finding application
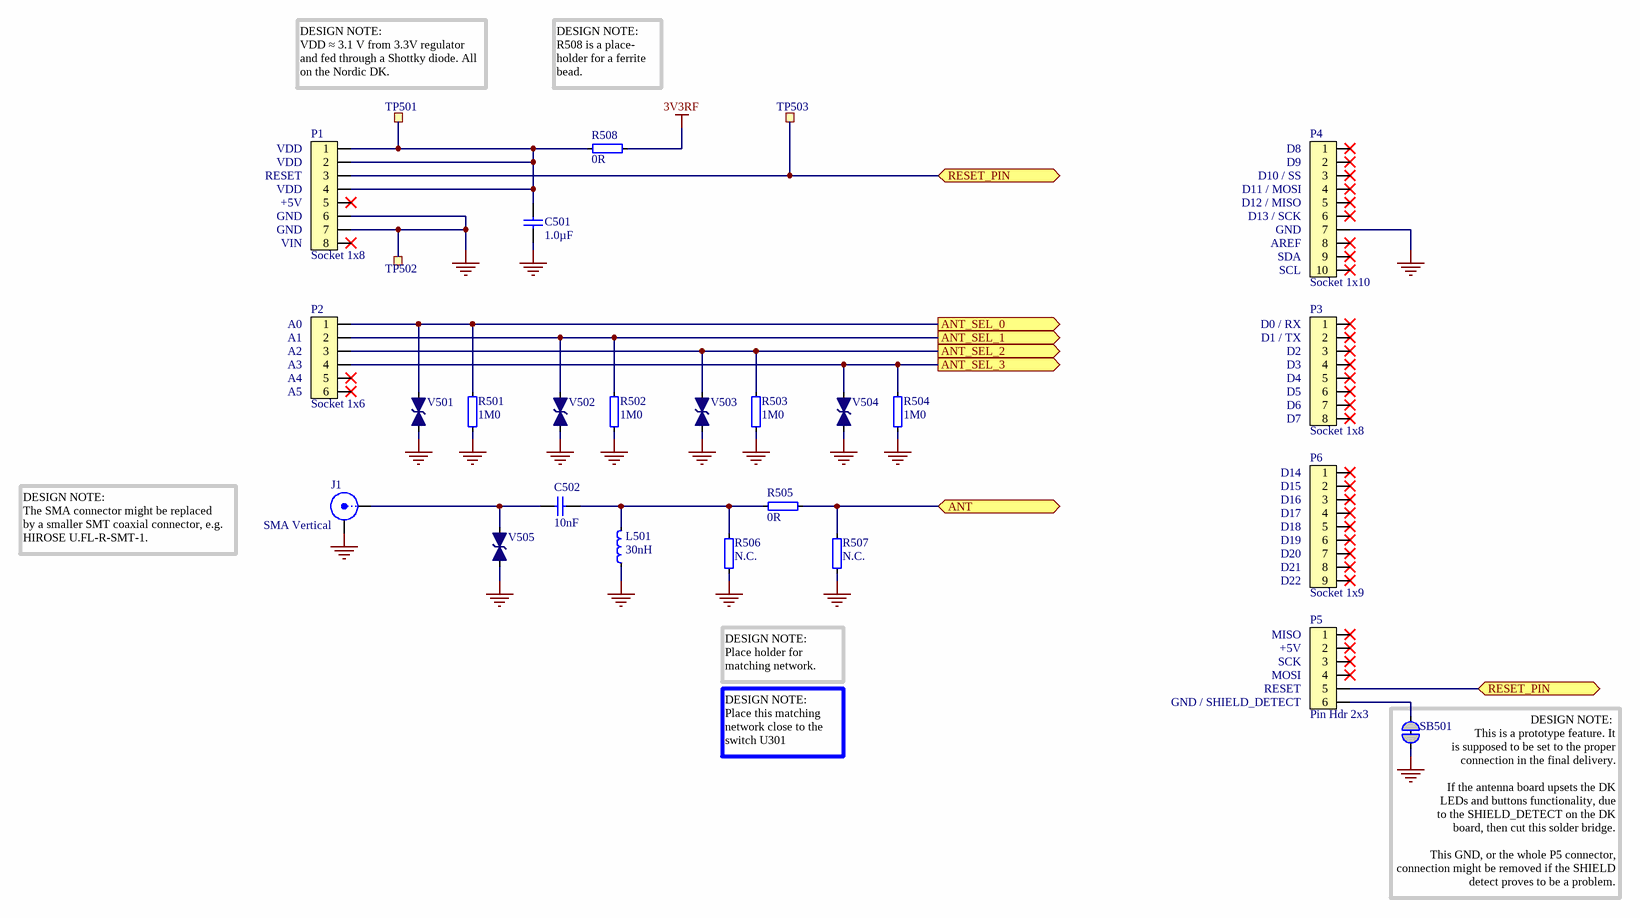
[diagram p4: pca20054_sheet5_connectors.SchDoc]

### Parts
C501  1.0µF  [CAPC1608X06L]
C502  10nF  [CAPC1005X04L]
J1  SMA Vertical  [CON_SMA_COAX_FEM_STRAIGHT_5P_1]
L501  30nH  [INDC1005X04L_WW]
P1  Socket 1x8  [SOCKET_1x8_SMD]
P2  Socket 1x6  [SOCKET_1x6_SMD]
P3  Socket 1x8  [SOCKET_1x8_SMD]
P4  Socket 1x10  [SOCKET_1x10_SMD]
P5  Pin Hdr 2x3  [HDR_2x3-SMD]
P6  Socket 1x9  [SOCKET_1x9_SMD]
R501  1M0  [RESC1005X04L]
R502  1M0  [RESC1005X04L]
R503  1M0  [RESC1005X04L]
R504  1M0  [RESC1005X04L]
R505  0R  [RESC1005X04L]
R506  N.C.  [RESC1005X04L_NC]
R507  N.C.  [RESC1005X04L_NC]
R508  0R  [RESC1005X04L]
SB501  Solderbridge  [Solderbridge_Shorted_Power]  (value not drawn)  (net tie, no BOM)
TP501  Ø1.0mm,SMD  [TP_SMD_Ø1.0mm]  (value not drawn)  (no BOM)
TP502  Ø1.0mm,SMD  [TP_SMD_Ø1.0mm]  (value not drawn)  (no BOM)
TP503  Ø1.0mm,SMD  [TP_SMD_Ø1.0mm]  (value not drawn)  (no BOM)
V501  LXES15AAA1-133  [RESC1005X04L]  (value not drawn)
V502  LXES15AAA1-133  [RESC1005X04L]  (value not drawn)
V503  LXES15AAA1-133  [RESC1005X04L]  (value not drawn)
V504  LXES15AAA1-133  [RESC1005X04L]  (value not drawn)
V505  LXES15AAA1-133  [RESC1005X04L]  (value not drawn)

### Ports
ANT (bidir), ANT_SEL_0 (out), ANT_SEL_1 (out), ANT_SEL_2 (out), ANT_SEL_3 (out), RESET_PIN (bidir)

### Nets
3V3RF: R508.2
GND: C501.1 J1.2(Y) L501.1 P1.6 P1.7 P4.7 R501.1 R502.1 R503.1 R504.1 R506.1 R507.1 SB501.2 TP502.1 V501.2 V502.2 V503.2 V504.2 V505.2
ANT: R505.2 R507.2 ; port ANT
NetC501_2: C501.2 P1.1 P1.2 P1.4 R508.1 TP501.1
NetC502_1: C502.1 L501.2 R505.1 R506.2
NetC502_2: C502.2 J1.1(X) V505.1
NetP1_3: P1.3 P5.5 TP503.1 ; port RESET_PIN
NetP2_1: P2.1 R501.2 V501.1 ; port ANT_SEL_0
NetP2_2: P2.2 R502.2 V502.1 ; port ANT_SEL_1
NetP2_3: P2.3 R503.2 V503.1 ; port ANT_SEL_2
NetP2_4: P2.4 R504.2 V504.1 ; port ANT_SEL_3
NetP5_6: P5.6 SB501.1

Not connected (* = marked no-connect by the designer): P1 5* 8*; P2 5* 6*; P3 1* 2* 3* 4* 5* 6* 7* 8*; P4 1* 2* 3* 4* 5* 6* 8* 9* 10*; P5 1* 2* 3* 4*; P6 1* 2* 3* 4* 5* 6* 7* 8* 9*

### Notes on the sheet
- (near TP501) DESIGN NOTE:
  VDD ≈ 3.1 V from 3.3V regulator and fed through a Shottky diode. All on the Nordic DK.
- DESIGN NOTE:
  R508 is a place-
  holder for a ferrite bead.
- (near P1) VDD
- (near P1) RESET
- (near P4) D8
- (near P4) D9
- (near P4) D10 / SS
- (near P4) D11 / MOSI
- (near P1) +5V
- (near P1) GND
- (near P1) VIN
- (near P4) D12 / MISO
- (near P4) D13 / SCK
- (near P4) GND
- (near P4) AREF
- (near P4) SDA
- (near P4) SCL
- (near P2) A0
- (near P3) D0 / RX
- (near P2) A1
- (near P2) A2
- (near P2) A3
- (near P2) A4
- (near P2) A5
- (near P3) D1 / TX
- (near P3) D2
- (near P3) D3
- (near P3) D4
- (near P3) D5
- (near P3) D6
- (near P3) D7
- (near P6) D14
- (near P6) D15
- (near P6) D16
- (near P6) D17
- (near P6) D18
- (near P6) D19
- DESIGN NOTE:
  The SMA connector might be replaced
  by a smaller SMT coaxial connector, e.g.
  HIROSE U.FL-R-SMT-1.
- (near P6) D20
- (near P6) D21
- (near P6) D22
- (near P5) MISO
- (near P5) +5V
- (near P5) SCK
- (near P5) MOSI
- DESIGN NOTE:
  Place holder for matching network.
- (near P5) RESET
- (near P5) GND / SHIELD_DETECT
- DESIGN NOTE:
  Place this matching network close to the switch U301
- (near SB501) DESIGN NOTE:
  This is a prototype feature. It
  is supposed to be set to the proper
  connection in the final delivery.
  If the antenna board upsets the DK
  LEDs and buttons functionality, due
  to the SHIELD_DETECT on the DK
  board, then cut this solder bridge.
  This GND, or the whole P5 connector, connection might be removed if the SHIELD detect proves to be a problem.
- Size
- Date:
- Project Number
- Sheet         of
- Revision
- File:
- Drawn By:

### Library data of the parts
C501 = C0603-1µ0: as C301 on sheet pca20054_sheet3_antenna_switches; Part Number: C0603-1µ0; Manufacturer: *; Manufacturer Part Number: *; ComponentLink1URL: *; ComponentLink1Description: Datasheet; ComponentLink2URL: *; ComponentLink2Description: Supplier link; HelpURL: *; Footprint Doc: 0603; LatestRevisionDate: 2013-06-05; Pin Count: 2; Publisher: Nordic Semiconductor; Published: 2009-05-08; Value: 1.0µF; Supplier 1: *; Supplier Part Number 1: *; Supplier 2: *; Supplier Part Number 2: *
C502 = C0402-10n: as C330 on sheet pca20054_sheet3_antenna_switches; Part Number: C0402-10n; Manufacturer: *; Manufacturer Part Number: *; ComponentLink1URL: *; ComponentLink1Description: Datasheet; ComponentLink2URL: *; ComponentLink2Description: Supplier link; HelpURL: *; Footprint Doc: 0402; LatestRevisionDate: 2009-11-23; Pin Count: 2; Publisher: Nordic Semiconductor; Published: 2009-05-08; Value: 10nF; Supplier 1: *; Supplier Part Number 1: *; Supplier 2: *; Supplier Part Number 2: *
J1 = SMA-Vert-Std_Sigma: SMA Vertical connector; Artikkelnr Noca: N.A.; Part Number: SMA-Vert-Std_Sigma; Manufacturer: *; Manufacturer Part Number: *; ComponentLink1URL: *; ComponentLink1Description: Datasheet; ComponentLink2URL: *; ComponentLink2Description: Supplier link; HelpURL: *; Footprint Doc: SMA-VERT; LatestRevisionDate: 2009-12-12; Pin Count: 5; Publisher: Nordic Semiconductor; Published: 2009-12-12; Value: SMA Vertical; Note: SMA vertical; Supplier 1: *; Supplier Part Number 1: *; Supplier 2: *; Supplier Part Number 2: *; Part number IPS: N.A.
L501 = L0402-30n-Wirewound-Murata: Inductor, 270mA, ±2%, 580mΩ, Q=25; Manufacturer: Murata; Manufacturer Part Number: LQW15AN30NG00; Note: -55°C ~ 125°C; Artikkelnr Noca: N.A.; Part Number: L0402-30n-Wirewound-Murata; ComponentLink1URL: https://search.murata.co.jp/Ceramy/image/img/P02/JELF243A-0050.pdf; ComponentLink1Description: Datasheet; ComponentLink2URL: *; ComponentLink2Description: Supplier link; HelpURL: https://psearch.en.murata.com/inductor/product/LQW15AN30NG00%23.html; Footprint Doc: 0402; LatestRevisionDate: 2019-04-16; Pin Count: 2; Publisher: Nordic Semiconductor; Published: 2019-04-16; Value: 30nH; Supplier 1: Digi-Key; Supplier Part Number 1: 490-6802-1-ND; Supplier 2: *; Supplier Part Number 2: *; Part number IPS: N.A.
P1 P3 = Socket 1x8 SMD: Socket 1x8, 2.54mm (100mil), SMD; Manufacturer: W-CON; Manufacturer Part Number: 2171-108MS0CUNR1; Part number IPS: 00000009963; Artikkelnr Noca: 55030002; Part Number: Socket 1x8 SMD; ComponentLink1URL: *; ComponentLink1Description: Datasheet; ComponentLink2URL: *; ComponentLink2Description: Supplier link; HelpURL: *; Footprint Doc: SOCKET_1x8_SMD; LatestRevisionDate: 2017-10-23; Pin Count: 8; Publisher: Nordic Semiconductor; Published: 2016-01-22; Value: Socket 1x8; Note: *; Supplier 1: Cabcon; Supplier Part Number 1: 2171-108MS0CUNR1; Supplier 2: Samtec; Supplier Part Number 2: SSM-108-F-SV-P-TR
P2 = Socket 1x6 SMD: Socket 1x6, 2.54mm (100mil), SMD; Manufacturer: W-CON; Manufacturer Part Number: 2171-106MS0CUNR1; Part number IPS: 00000009964; Artikkelnr Noca: 55030001; Part Number: Socket 1x6 SMD; ComponentLink1URL: *; ComponentLink1Description: Datasheet; ComponentLink2URL: *; ComponentLink2Description: Supplier link; HelpURL: *; Footprint Doc: SOCKET_1x6_SMD; LatestRevisionDate: 2017-10-23; Pin Count: 6; Publisher: Nordic Semiconductor; Published: 2016-01-22; Value: Socket 1x6; Note: *; Supplier 1: Cabcon; Supplier Part Number 1: 2171-106MS0CUNR1; Supplier 2: Samtec; Supplier Part Number 2: SSM-106-F-SV-P-TR
P4 = Socket 1x10 SMD: Socket 1x10, 2.54mm (100mil), SMD; Manufacturer: W-CON; Manufacturer Part Number: 2171-110MS0CUNR1; Part number IPS: 00000009965; Artikkelnr Noca: 55030004; Part Number: Socket 1x10 SMD; ComponentLink1URL: *; ComponentLink1Description: Datasheet; ComponentLink2URL: *; ComponentLink2Description: Supplier link; HelpURL: *; Footprint Doc: SOCKET_1x10_SMD; LatestRevisionDate: 2016-01-22; Pin Count: 10; Publisher: Nordic Semiconductor; Published: 2016-01-22; Value: Socket 1x10; Note: *; Supplier 1: Cabcon; Supplier Part Number 1: 2171-110MS0CUNR1; Supplier 2: Samtec; Supplier Part Number 2: SSM-110-F-SV-P-TR
P5 = Pin Header 2x3 SMD: Pin Header 2x3, 2.54mm (100mil) SMD; Manufacturer: W-CON; Manufacturer Part Number: 1125-1203S0M116R1; Part number IPS: 00000009966; Artikkelnr Noca: 55010007; Part Number: Pin Header 2x3 SMD; ComponentLink1URL: *; ComponentLink1Description: Datasheet; ComponentLink2URL: *; ComponentLink2Description: Supplier link; HelpURL: \\hizz\pro\app9717\Datasheet\connectors\W-CON\1125-12XXXXMXXXXX.PDF; Footprint Doc: HDR_2x3-SMD; LatestRevisionDate: 2016-01-22; Pin Count: 6; Publisher: Nordic Semiconductor; Published: 2016-01-22; Value: Pin Hdr 2x3; Note: SMD; Supplier 1: Cabcon; Supplier Part Number 1: 1125-1203S0M116R1; Supplier 2: Samtec; Supplier Part Number 2: TSM-103-01-L-DV
P6 = Socket 1x9 SMD: Socket 1x9, 2.54mm (100mil), SMD; Manufacturer: W-CON; Manufacturer Part Number: 2171-109MS0CUNR1; Part number IPS: N.A.; Artikkelnr Noca: 55030003; Part Number: Socket 1x9 SMD; ComponentLink1URL: *; ComponentLink1Description: Datasheet; ComponentLink2URL: *; ComponentLink2Description: Supplier link; HelpURL: *; Footprint Doc: SOCKET_1x9_SMD; LatestRevisionDate: 2017-10-23; Pin Count: 9; Publisher: Nordic Semiconductor; Published: 2016-01-22; Value: Socket 1x9; Note: *; Supplier 1: Cabcon; Supplier Part Number 1: 2171-109MS0CUNR1; Supplier 2: Samtec; Supplier Part Number 2: SSM-109-L-SV-P-TR
R501-R504 = R0402-1M0: Resistor, ±1%, 0.063W; Part number IPS: 00000006807; Note: Chip Res 1%; Artikkelnr Noca: 27049145; Part Number: R0402-1M0; Manufacturer: *; Manufacturer Part Number: *; ComponentLink1URL: *; ComponentLink1Description: Datasheet; ComponentLink2URL: *; ComponentLink2Description: Supplier link; HelpURL: *; Footprint Doc: 0402; LatestRevisionDate: 2009-11-23; Pin Count: 2; Publisher: Nordic Semiconductor; Published: 2009-05-08; Value: 1M0; Supplier 1: *; Supplier Part Number 1: *; Supplier 2: *; Supplier Part Number 2: *
R505 R508 = R0402-0R: as R301 on sheet pca20054_sheet3_antenna_switches; Part Number: R0402-0R; Manufacturer: *; Manufacturer Part Number: *; ComponentLink1URL: *; ComponentLink1Description: Datasheet; ComponentLink2URL: *; ComponentLink2Description: Supplier link; HelpURL: *; Footprint Doc: 0402; LatestRevisionDate: 2009-11-23; Pin Count: 2; Publisher: Nordic Semiconductor; Published: 2009-05-08; Value: 0R; Supplier 1: Farnell; Supplier Part Number 1: 146-9661; Supplier 2: *; Supplier Part Number 2: *
R506 R507 = R0402-N.C.: as R302 on sheet pca20054_sheet3_antenna_switches; Part Number: R0402-N.C.; Manufacturer: *; Manufacturer Part Number: *; ComponentLink1URL: *; ComponentLink1Description: Datasheet; ComponentLink2URL: *; ComponentLink2Description: Supplier link; HelpURL: *; Footprint Doc: 0402; LatestRevisionDate: 2009-05-08; Pin Count: 2; Publisher: Nordic Semiconductor; Published: 2009-05-08; Value: N.C.; Supplier 1: *; Supplier Part Number 1: *; Supplier 2: *; Supplier Part Number 2: *; Part number IPS: N.A.
SB501 = Solderbridge Shorted Power: Shorted Solderbridge Power; Artikkelnr Noca: N.A.; Part Number: Solderbridge Shorted Power; Manufacturer: *; Manufacturer Part Number: *; ComponentLink1URL: *; ComponentLink1Description: Datasheet; ComponentLink2URL: *; ComponentLink2Description: Supplier link; HelpURL: *; Footprint Doc: Solderbridge_Shorted_Power; LatestRevisionDate: 2012-08-07; Pin Count: 2; Publisher: Nordic Semiconductor; Published: 2012-08-07; Value: Solderbridge; Note: *; Supplier 1: *; Supplier Part Number 1: *; Supplier 2: *; Supplier Part Number 2: *; Part number IPS: N.A.
TP501-TP503 = TP_SMD_Ø1.0MM: as ANT_1 on sheet pca20054_sheet3_antenna_switches; Part Number: TP_SMD_Ø1.0MM; Manufacturer Part Number: *; ComponentLink1URL: *; ComponentLink1Description: Datasheet; ComponentLink2URL: *; ComponentLink2Description: Supplier link; HelpURL: *; Footprint Doc: TP_SMD_Ø1.0mm; LatestRevisionDate: 2013-06-11; Pin Count: 1; Publisher: Nordic Semiconductor; Published: 2013-06-11; Value: Ø1.0mm,SMD; Note: *; Supplier 1: *; Supplier Part Number 1: *; Supplier 2: *; Supplier Part Number 2: *; Part number IPS: N.A.
V501-V505 = LXES15AAA1-133: as V301 on sheet pca20054_sheet3_antenna_switches; Part Number: LXES15AAA1-133; Manufacturer Part Number: LXES15AAA1-133; ComponentLink1URL: *; ComponentLink1Description: Datasheet; ComponentLink2URL: *; ComponentLink2Description: Supplier link; HelpURL: http://www.murata.com/en-us/products/productdata/8796832759838/CRESD-E.pdf; Footprint Doc: 0402; LatestRevisionDate: 2017-09-20; Pin Count: 2; Publisher: Nordic Semiconductor; Published: 2017-09-20; Value: LXES15AAA1-133; Note: *; Supplier 1: Digi-Key; Supplier Part Number 1: 490-13209-6-ND; Supplier 2: Mouser; Supplier Part Number 2: 81-LXES15AAA1-133; Part number IPS: N.A.

## Nets that join several sheets
3V3RF: pca20054_sheet3_antenna_switches (20 pins), pca20054_sheet4_power_control (R401.1 R402.2), pca20054_sheet5_connectors (R508.2)
3V3RFN: pca20054_sheet3_antenna_switches (15 pins), pca20054_sheet4_power_control (R405.2)
GND: pca20054_sheet3_antenna_switches (157 pins), pca20054_sheet4_power_control (8 pins), pca20054_sheet5_connectors (19 pins)
ANT: pca20054_sheet3_antenna_switches (U301.22), pca20054_sheet5_connectors (R505.2 R507.2)
NetP1_3: pca20054_sheet4_power_control (SW401.1), pca20054_sheet5_connectors (P1.3 P5.5 TP503.1)
NetP2_1: pca20054_sheet3_antenna_switches (R349.1), pca20054_sheet5_connectors (P2.1 R501.2 V501.1)
NetP2_2: pca20054_sheet3_antenna_switches (R350.1), pca20054_sheet5_connectors (P2.2 R502.2 V502.1)
NetP2_3: pca20054_sheet3_antenna_switches (R351.1), pca20054_sheet5_connectors (P2.3 R503.2 V503.1)
NetP2_4: pca20054_sheet3_antenna_switches (R352.1), pca20054_sheet5_connectors (P2.4 R504.2 V504.1)